# EAGLE design mainboard-nohdmi (EAGLE 8.4.1)

## Sheet 1 of 5
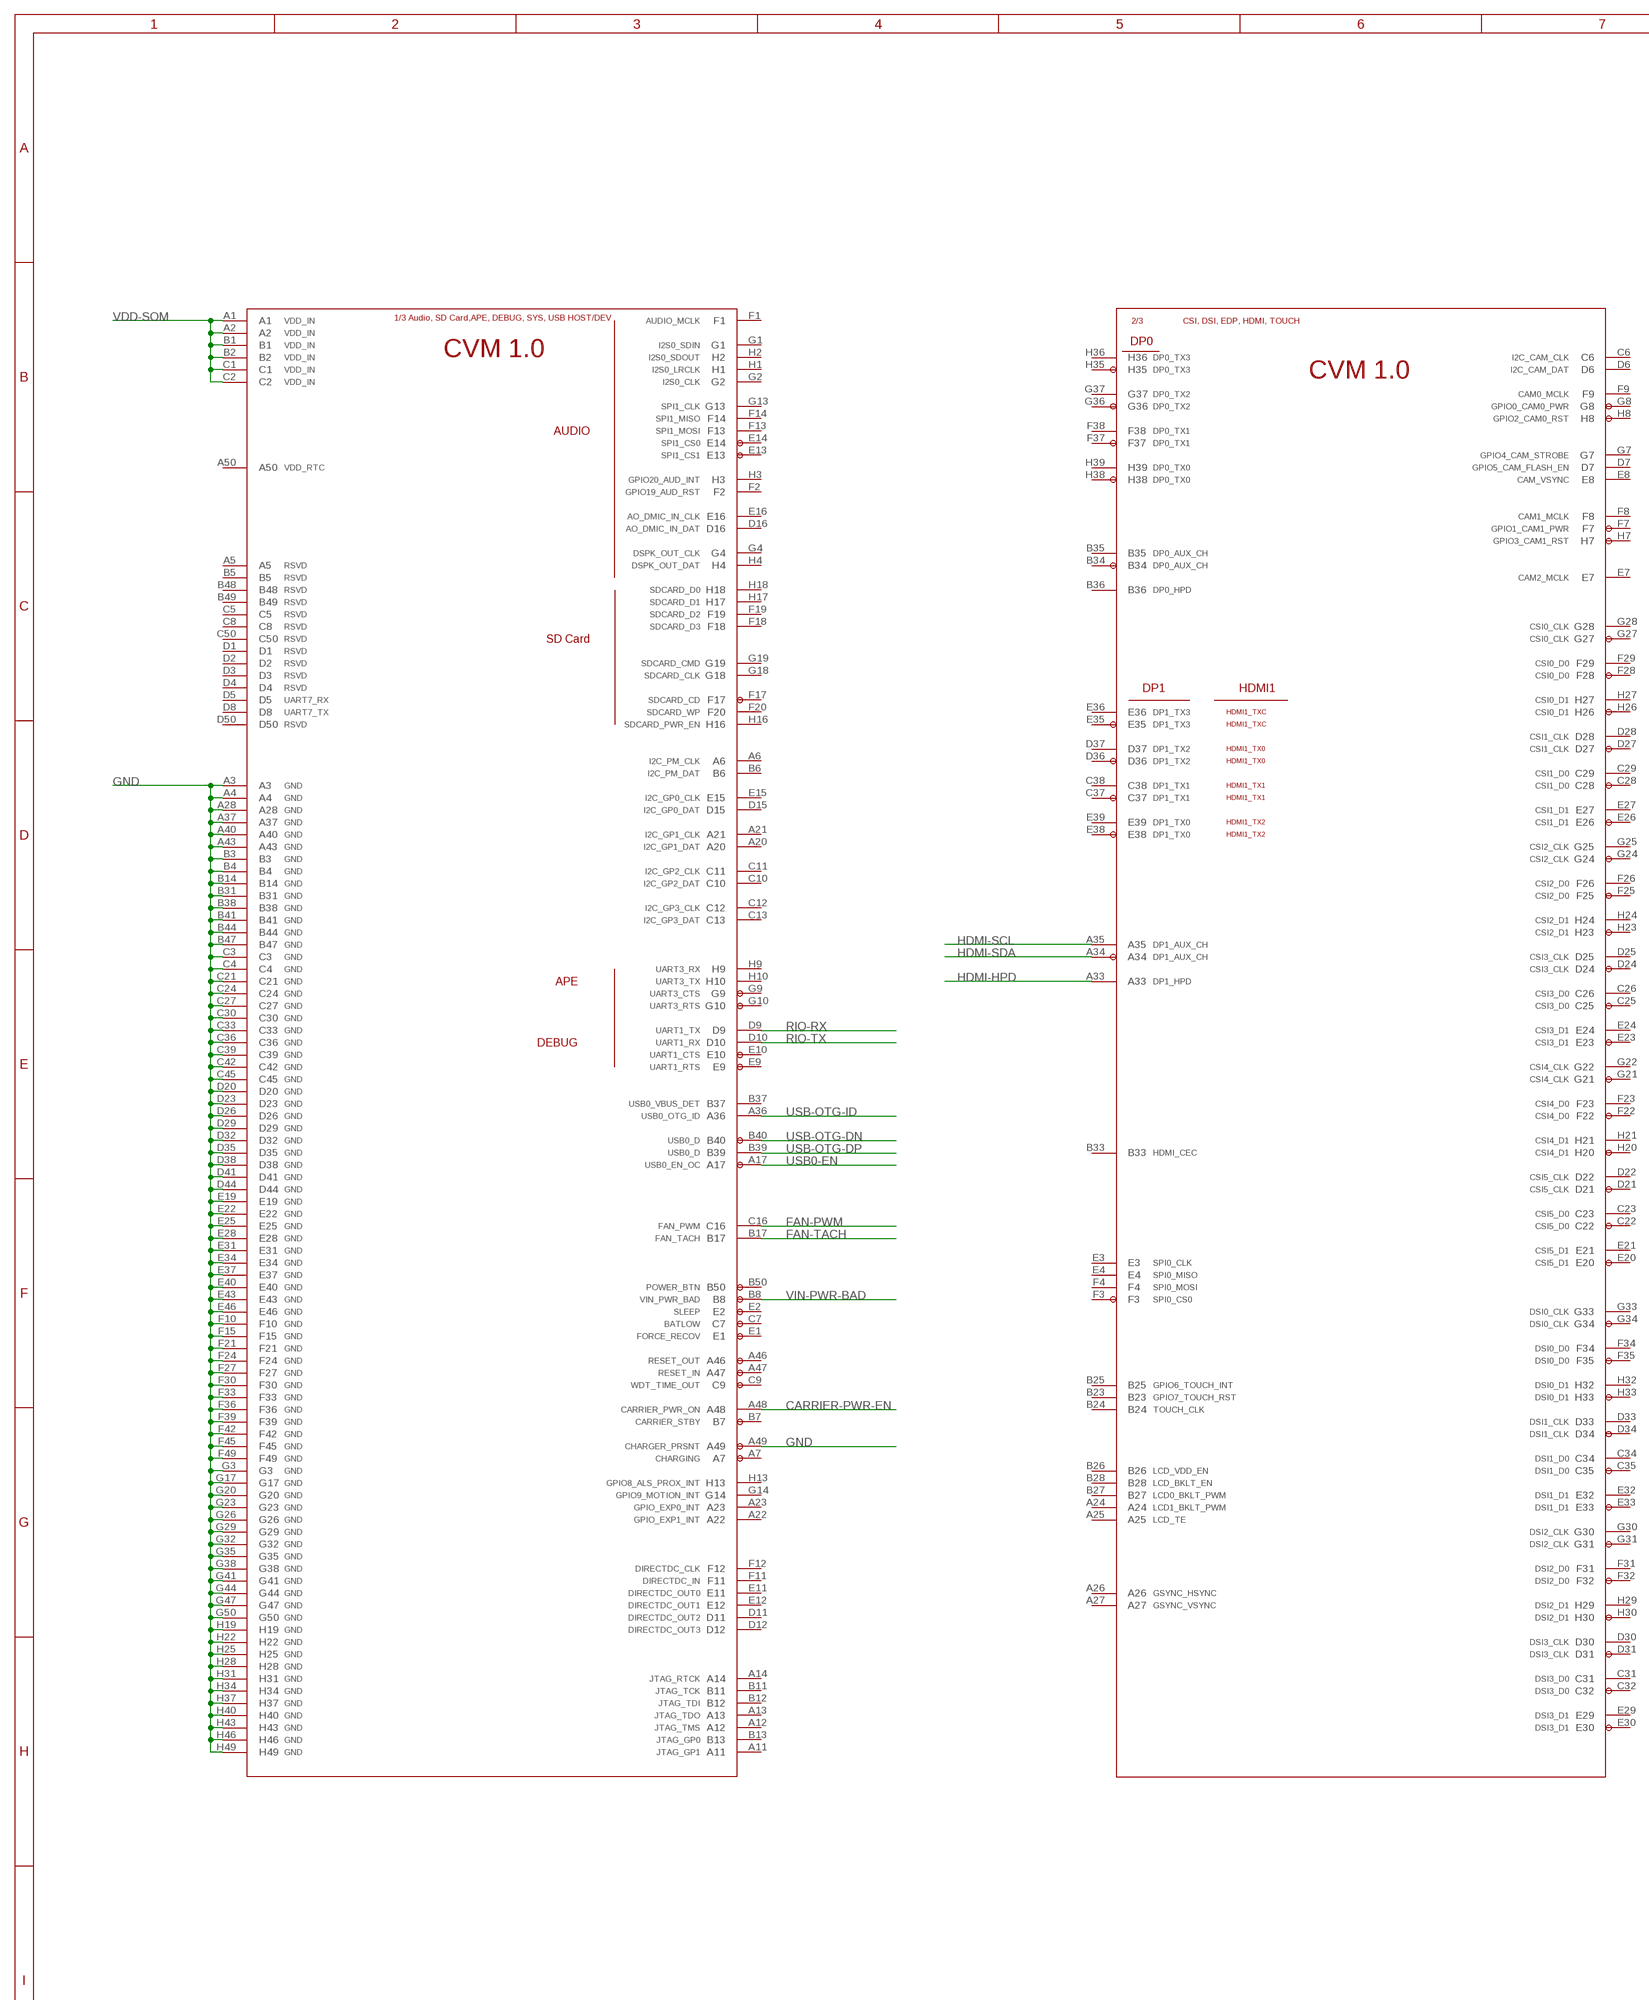
[diagram p0: schematic, sheet 1, part 1 of 2]
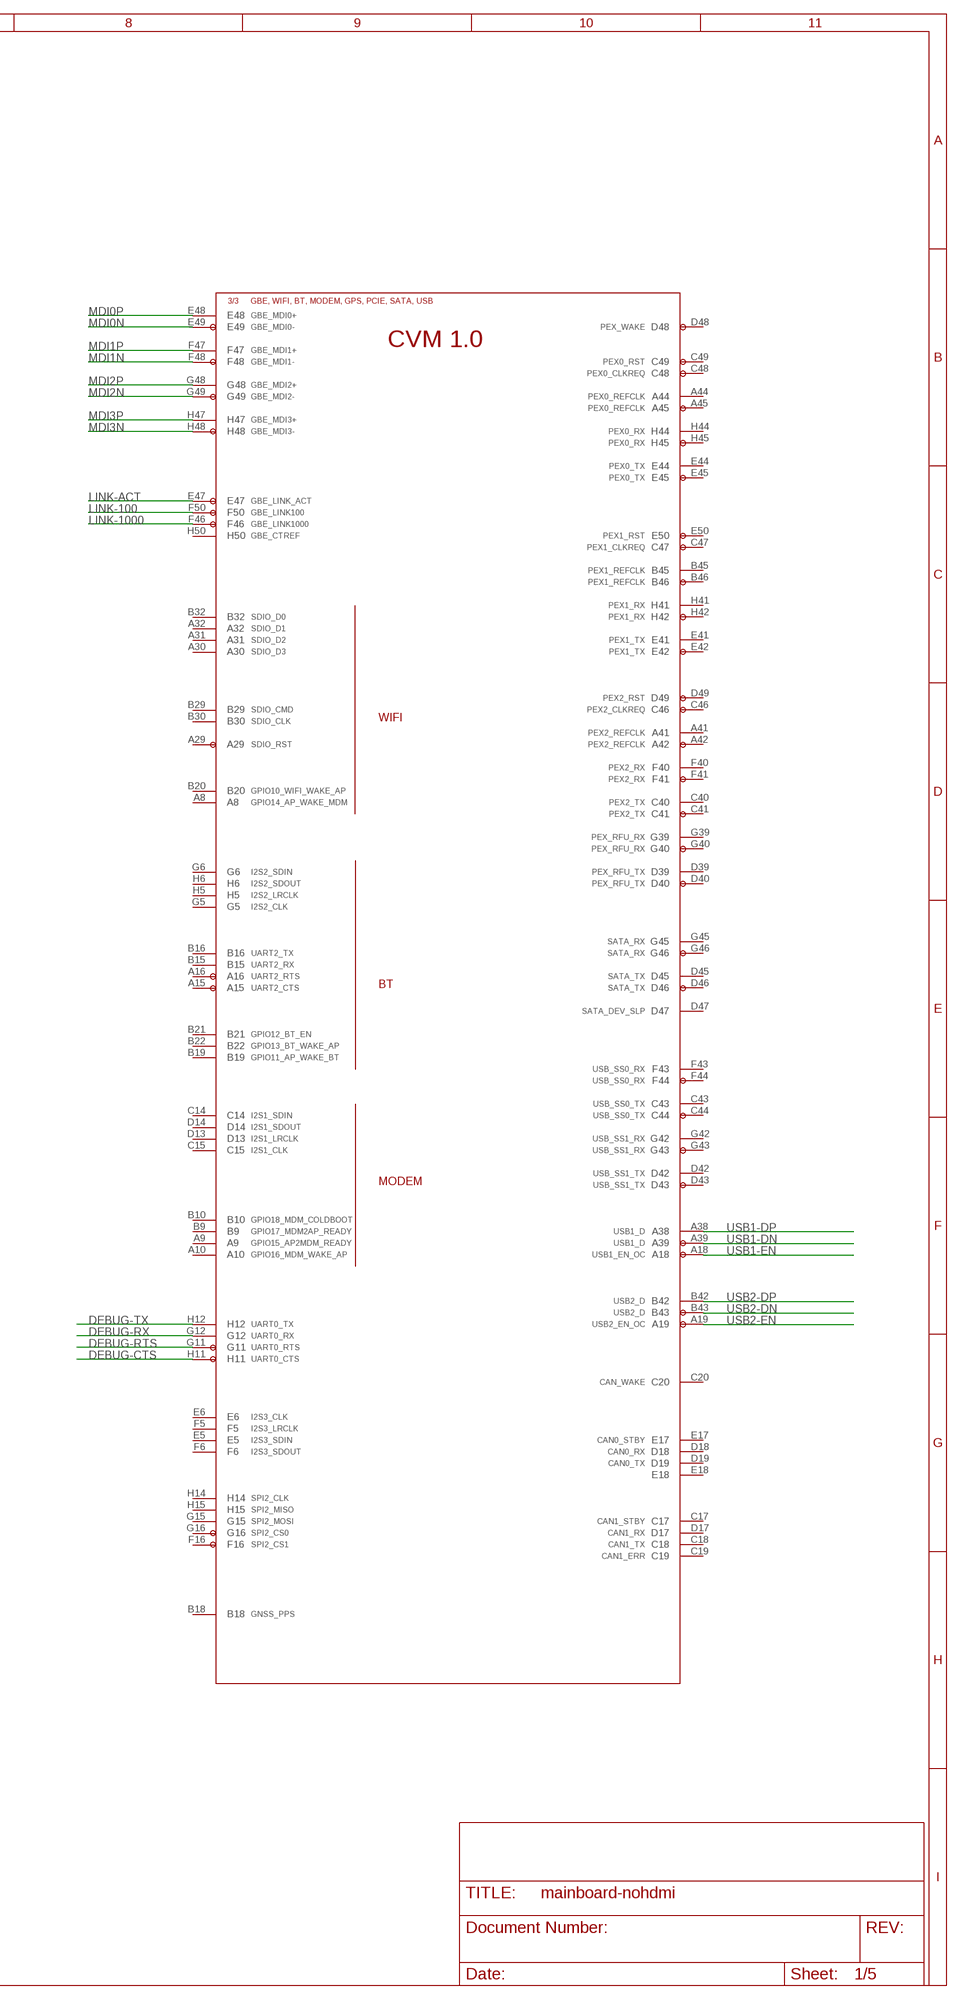
[diagram p1: schematic, sheet 1, part 2 of 2]

### Parts
U$1  JETSON-TX1  [SEAM-50-02.0-L-08-2-A-K-TR]

### Nets
CARRIER-PWR-EN: U$1.A48 ; also sheet 3
DEBUG-CTS: U$1.H11
DEBUG-RTS: U$1.G11
DEBUG-RX: U$1.G12 ; also sheet 3
DEBUG-TX: U$1.H12 ; also sheet 3
FAN-PWM: U$1.C16
FAN-TACH: U$1.B17
GND: U$1.A3 U$1.A4 U$1.A28 U$1.A37 U$1.A40 U$1.A43 U$1.A49 U$1.B3 U$1.B4 U$1.B14 U$1.B31 U$1.B38 U$1.B41 U$1.B44 U$1.B47 U$1.C3 U$1.C4 U$1.C21 U$1.C24 U$1.C27 U$1.C30 U$1.C33 U$1.C36 U$1.C39 U$1.C42 U$1.C45 U$1.D20 U$1.D23 U$1.D26 U$1.D29 U$1.D32 U$1.D35 U$1.D38 U$1.D41 U$1.D44 U$1.E19 U$1.E22 U$1.E25 U$1.E28 U$1.E31 U$1.E34 U$1.E37 U$1.E40 U$1.E43 U$1.E46 U$1.F10 U$1.F15 U$1.F21 U$1.F24 U$1.F27 U$1.F30 U$1.F33 U$1.F36 U$1.F39 U$1.F42 U$1.F45 U$1.F49 U$1.G3 U$1.G17 U$1.G20 U$1.G23 U$1.G26 U$1.G29 U$1.G32 U$1.G35 U$1.G38 U$1.G41 U$1.G44 U$1.G47 U$1.G50 U$1.H19 U$1.H22 U$1.H25 U$1.H28 U$1.H31 U$1.H34 U$1.H37 U$1.H40 U$1.H43 U$1.H46 U$1.H49 ; also sheet 2,3,4,5
HDMI-HPD: U$1.A33
HDMI-SCL: U$1.A35
HDMI-SDA: U$1.A34
LINK-100: U$1.F50 ; also sheet 5
LINK-1000: U$1.F46
LINK-ACT: U$1.E47 ; also sheet 5
MDI0N: U$1.E49 ; also sheet 5
MDI0P: U$1.E48 ; also sheet 5
MDI1N: U$1.F48 ; also sheet 5
MDI1P: U$1.F47 ; also sheet 5
MDI2N: U$1.G49 ; also sheet 5
MDI2P: U$1.G48 ; also sheet 5
MDI3N: U$1.H48 ; also sheet 5
MDI3P: U$1.H47 ; also sheet 5
RIO-RX: U$1.D9 ; also sheet 2
RIO-TX: U$1.D10 ; also sheet 2
USB0-EN: U$1.A17 ; also sheet 4
USB1-DN: U$1.A39 ; also sheet 4
USB1-DP: U$1.A38 ; also sheet 4
USB1-EN: U$1.A18 ; also sheet 4
USB2-DN: U$1.B43 ; also sheet 4
USB2-DP: U$1.B42 ; also sheet 4
USB2-EN: U$1.A19 ; also sheet 4
USB-OTG-DN: U$1.B40 ; also sheet 4
USB-OTG-DP: U$1.B39 ; also sheet 4
USB-OTG-ID: U$1.A36 ; also sheet 4
VDD-SOM: U$1.A1 U$1.A2 U$1.B1 U$1.B2 U$1.C1 U$1.C2 ; also sheet 3
VIN-PWR-BAD: U$1.B8 ; also sheet 3
Unconnected: U$1.A5 U$1.A6 U$1.A7 U$1.A8 U$1.A9 U$1.A10 U$1.A11 U$1.A12 U$1.A13 U$1.A14 U$1.A15 U$1.A16 U$1.A20 U$1.A21 U$1.A22 U$1.A23 U$1.A24 U$1.A25 U$1.A26 U$1.A27 U$1.A29 U$1.A30 U$1.A31 U$1.A32 U$1.A41 U$1.A42 U$1.A44 U$1.A45 U$1.A46 U$1.A47 U$1.A50 U$1.B5 U$1.B6 U$1.B7 U$1.B9 U$1.B10 U$1.B11 U$1.B12 U$1.B13 U$1.B15 U$1.B16 U$1.B18 U$1.B19 U$1.B20 U$1.B21 U$1.B22 U$1.B23 U$1.B24 U$1.B25 U$1.B26 U$1.B27 U$1.B28 U$1.B29 U$1.B30 U$1.B32 U$1.B33 U$1.B34 U$1.B35 U$1.B36 U$1.B37 U$1.B45 U$1.B46 U$1.B48 U$1.B49 U$1.B50 U$1.C5 U$1.C6 U$1.C7 U$1.C8 U$1.C9 U$1.C10 U$1.C11 U$1.C12 U$1.C13 U$1.C14 U$1.C15 U$1.C17 U$1.C18 U$1.C19 U$1.C20 U$1.C22 U$1.C23 U$1.C25 U$1.C26 U$1.C28 U$1.C29 U$1.C31 U$1.C32 U$1.C34 U$1.C35 U$1.C37 U$1.C38 U$1.C40 U$1.C41 U$1.C43 U$1.C44 U$1.C46 U$1.C47 U$1.C48 U$1.C49 U$1.C50 U$1.D1 U$1.D2 U$1.D3 U$1.D4 U$1.D5 U$1.D6 U$1.D7 U$1.D8 U$1.D11 U$1.D12 U$1.D13 U$1.D14 U$1.D15 U$1.D16 U$1.D17 U$1.D18 U$1.D19 U$1.D21 U$1.D22 U$1.D24 U$1.D25 U$1.D27 U$1.D28 U$1.D30 U$1.D31 U$1.D33 U$1.D34 U$1.D36 U$1.D37 U$1.D39 U$1.D40 U$1.D42 U$1.D43 U$1.D45 U$1.D46 U$1.D47 U$1.D48 U$1.D49 U$1.D50 U$1.E1 U$1.E2 U$1.E3 U$1.E4 U$1.E5 U$1.E6 U$1.E7 U$1.E8 U$1.E9 U$1.E10 U$1.E11 U$1.E12 U$1.E13 U$1.E14 U$1.E15 U$1.E16 U$1.E17 U$1.E18 U$1.E20 U$1.E21 U$1.E23 U$1.E24 U$1.E26 U$1.E27 U$1.E29 U$1.E30 U$1.E32 U$1.E33 U$1.E35 U$1.E36 U$1.E38 U$1.E39 U$1.E41 U$1.E42 U$1.E44 U$1.E45 U$1.E50 U$1.F1 U$1.F2 U$1.F3 U$1.F4 U$1.F5 U$1.F6 U$1.F7 U$1.F8 U$1.F9 U$1.F11 U$1.F12 U$1.F13 U$1.F14 U$1.F16 U$1.F17 U$1.F18 U$1.F19 U$1.F20 U$1.F22 U$1.F23 U$1.F25 U$1.F26 U$1.F28 U$1.F29 U$1.F31 U$1.F32 U$1.F34 U$1.F35 U$1.F37 U$1.F38 U$1.F40 U$1.F41 U$1.F43 U$1.F44 U$1.G1 U$1.G2 U$1.G4 U$1.G5 U$1.G6 U$1.G7 U$1.G8 U$1.G9 U$1.G10 U$1.G13 U$1.G14 U$1.G15 U$1.G16 U$1.G18 U$1.G19 U$1.G21 U$1.G22 U$1.G24 U$1.G25 U$1.G27 U$1.G28 U$1.G30 U$1.G31 U$1.G33 U$1.G34 U$1.G36 U$1.G37 U$1.G39 U$1.G40 U$1.G42 U$1.G43 U$1.G45 U$1.G46 U$1.H1 U$1.H2 U$1.H3 U$1.H4 U$1.H5 U$1.H6 U$1.H7 U$1.H8 U$1.H9 U$1.H10 U$1.H13 U$1.H14 U$1.H15 U$1.H16 U$1.H17 U$1.H18 U$1.H20 U$1.H21 U$1.H23 U$1.H24 U$1.H26 U$1.H27 U$1.H29 U$1.H30 U$1.H32 U$1.H33 U$1.H35 U$1.H36 U$1.H38 U$1.H39 U$1.H41 U$1.H42 U$1.H44 U$1.H45 U$1.H50

## Sheet 2 of 5: MXP connector
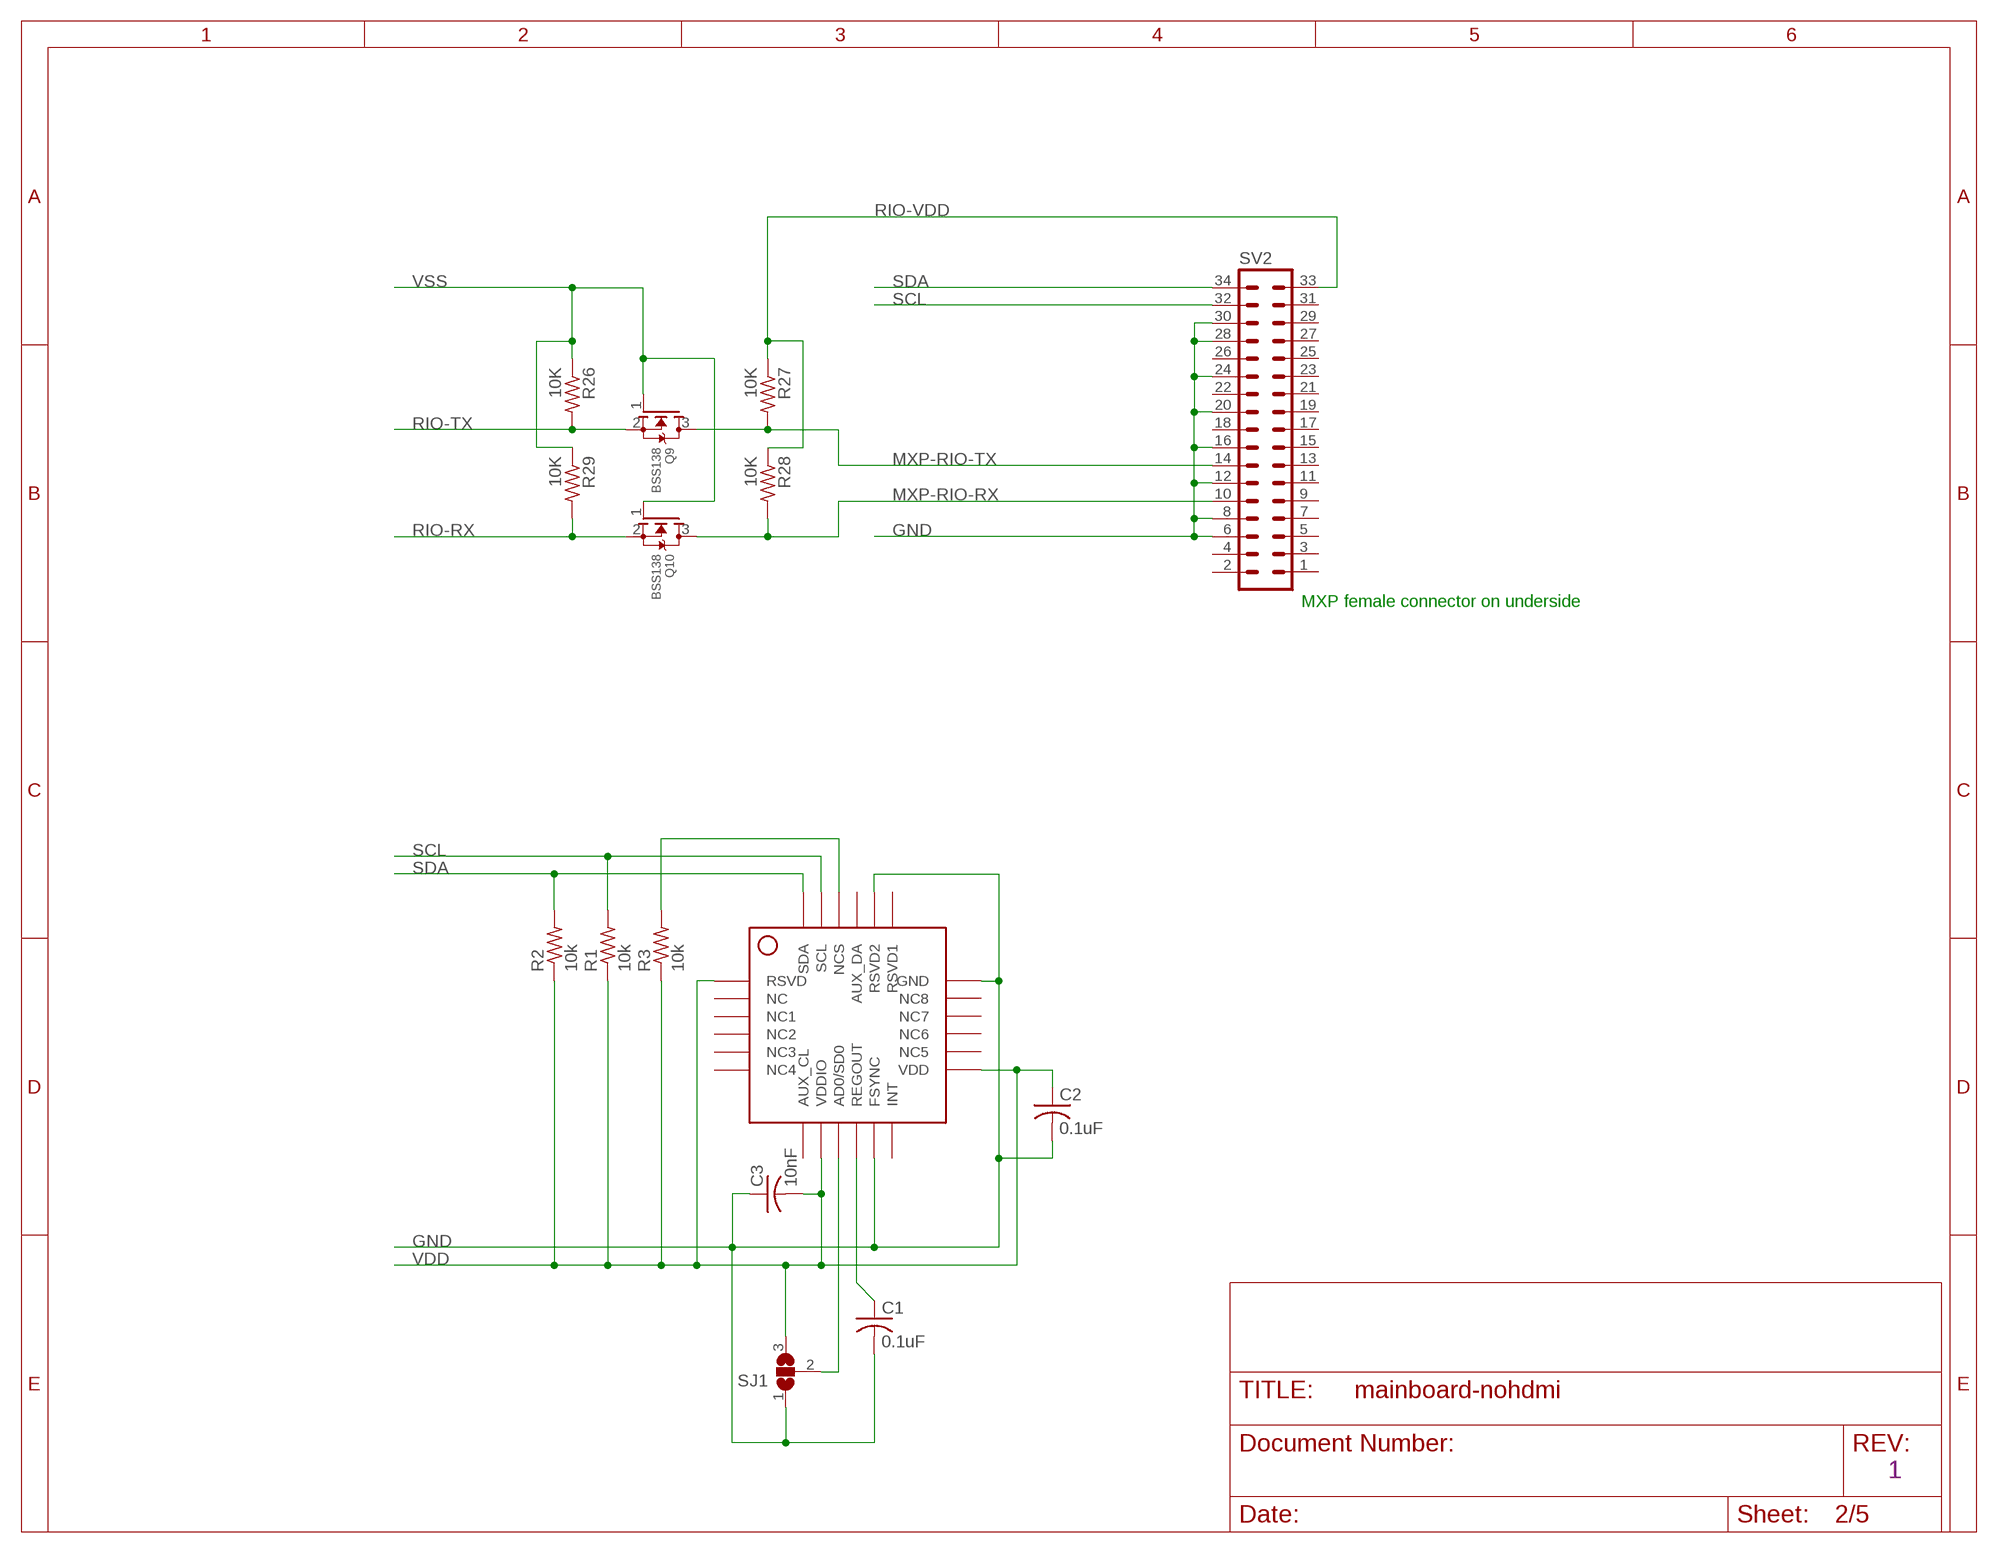
[diagram p2: schematic, sheet 2]

### Parts
C1  0.1uF  C-USC0603  [C0603]
C2  0.1uF  C-USC0603  [C0603]
C3  10nF  C-USC0603  [C0603]
Q9  BSS138  MOSFET-NREFLOW  [SOT23]
Q10  BSS138  MOSFET-NREFLOW  [SOT23]
R1  10k  R-US_R0603  [R0603]
R2  10k  R-US_R0603  [R0603]
R3  10k  R-US_R0603  [R0603]
R26  10K  R-US_R0603  [R0603]
R27  10K  R-US_R0603  [R0603]
R28  10K  R-US_R0603  [R0603]
R29  10K  R-US_R0603  [R0603]
SJ1  SJ2W  [SJ_2]
SV2  MA17-2  [MA17-2]
U$4  MPU9250  [QFN3X3]

### Nets
GND: C1.2 C2.2 C3.1 SJ1.1 SV2.6 SV2.8 SV2.12 SV2.16 SV2.20 SV2.24 SV2.28 SV2.30 U$4.P$11(FSYNC) U$4.P$18(GND) U$4.P$20(RSVD2) U$4.P$25(GND) ; also sheet 1,3,4,5
MXP-RIO-RX: Q10.3(D) R28.2 SV2.10
MXP-RIO-TX: Q9.3(D) R27.2 SV2.14
N$7: C1.1 U$4.P$10(REGOUT)
N$8: SJ1.2 U$4.P$9(AD0/SD0)
N$9: R3.2 U$4.P$22(NCS)
RIO-RX: Q10.2(S) R29.2 ; also sheet 1
RIO-TX: Q9.2(S) R26.2 ; also sheet 1
RIO-VDD: R27.1 R28.1 SV2.33
SCL: R1.2 SV2.32 U$4.P$23(SCL)
SDA: R2.2 SV2.34 U$4.P$24(SDA)
VDD: C2.1 C3.2 R1.1 R2.1 R3.1 SJ1.3 U$4.P$1(RSVD) U$4.P$8(VDDIO) U$4.P$13(VDD) ; also sheet 3,5
VSS: Q9.1(G) Q10.1(G) R26.1 R29.1 ; also sheet 3
Unconnected: SV2.1 SV2.2 SV2.3 SV2.4 SV2.5 SV2.7 SV2.9 SV2.11 SV2.13 SV2.15 SV2.17 SV2.18 SV2.19 SV2.21 SV2.22 SV2.23 SV2.25 SV2.26 SV2.27 SV2.29 SV2.31 U$4.P$2(NC) U$4.P$3(NC1) U$4.P$4(NC2) U$4.P$5(NC3) U$4.P$6(NC4) U$4.P$7(AUX_CL) U$4.P$12(INT) U$4.P$14(NC5) U$4.P$15(NC6) U$4.P$16(NC7) U$4.P$17(NC8) U$4.P$19(RSVD1) U$4.P$21(AUX_DA)

### Notes on the sheet
- MXP female connector on underside
- 1

## Sheet 3 of 5: Other onboard IO
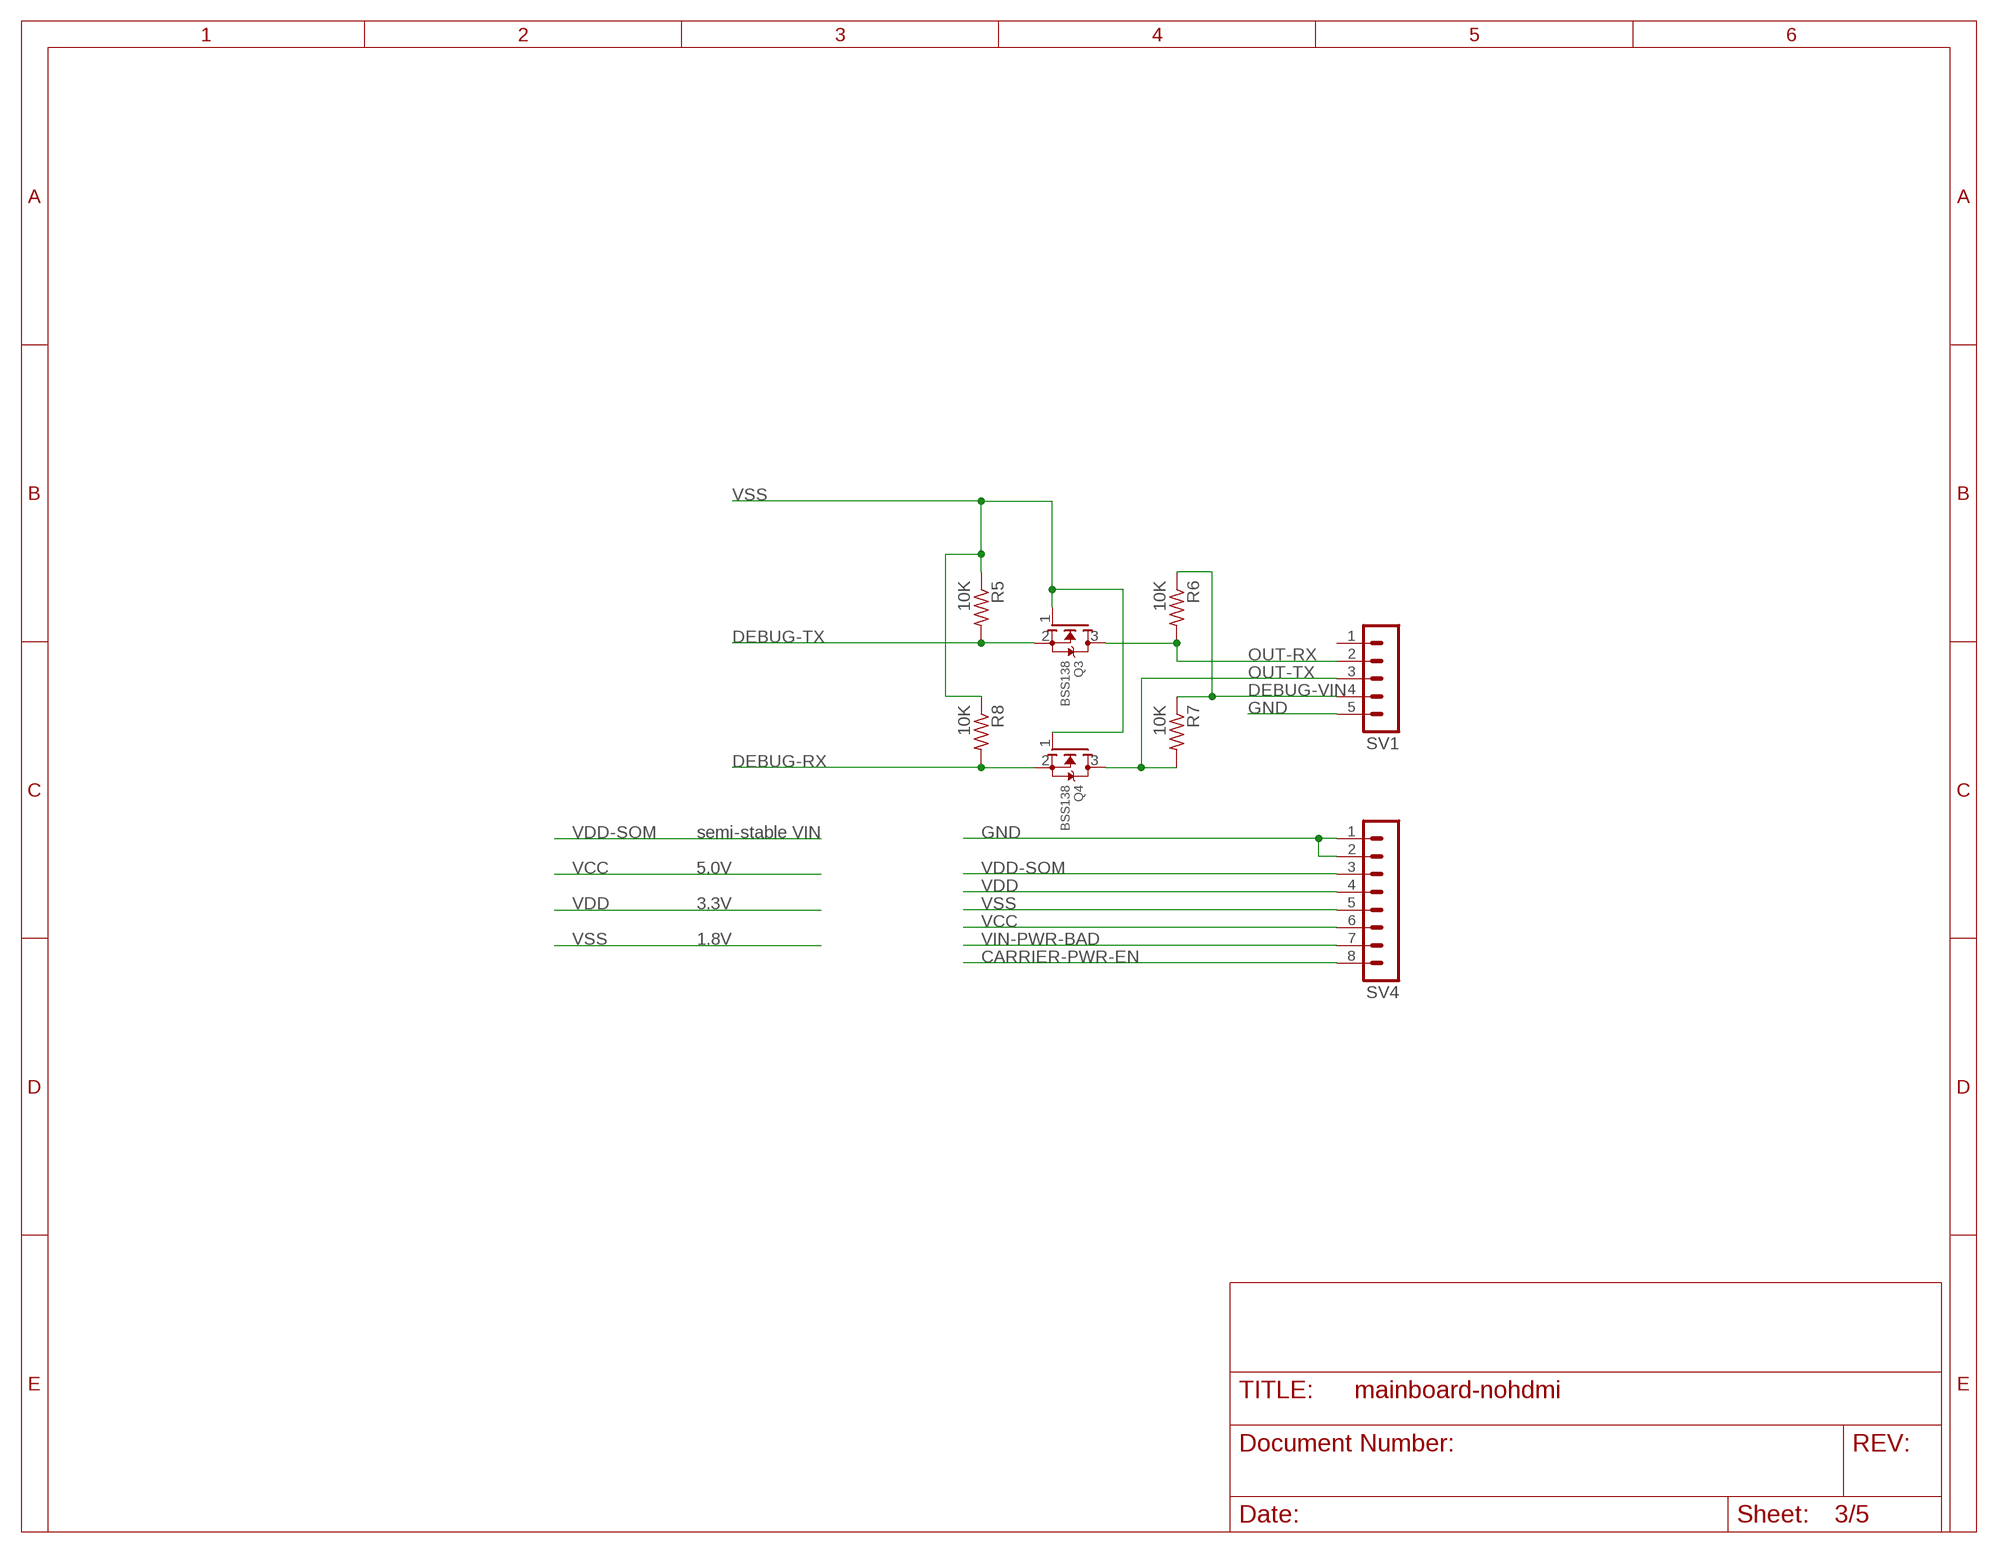
[diagram p3: schematic, sheet 3]

### Parts
Q3  BSS138  MOSFET-NREFLOW  [SOT23]
Q4  BSS138  MOSFET-NREFLOW  [SOT23]
R5  10K  R-US_R0603  [R0603]
R6  10K  R-US_R0603  [R0603]
R7  10K  R-US_R0603  [R0603]
R8  10K  R-US_R0603  [R0603]
SV1  MA05-1  [MA05-1]
SV4  MA08-1  [MA08-1]

### Nets
CARRIER-PWR-EN: SV4.8 ; also sheet 1
DEBUG-RX: Q4.2(S) R8.2 ; also sheet 1
DEBUG-TX: Q3.2(S) R5.2 ; also sheet 1
DEBUG-VIN: R6.1 R7.1 SV1.4
GND: SV1.5 SV4.1 SV4.2 ; also sheet 1,2,4,5
OUT-RX: Q3.3(D) R6.2 SV1.2
OUT-TX: Q4.3(D) R7.2 SV1.3
VCC: SV4.6 ; also sheet 4
VDD: SV4.4 ; also sheet 2,5
VDD-SOM: SV4.3 ; also sheet 1
VIN-PWR-BAD: SV4.7 ; also sheet 1
VSS: Q3.1(G) Q4.1(G) R5.1 R8.1 SV4.5 ; also sheet 2
Unconnected: SV1.1

### Notes on the sheet
- semi-stable VIN
- 5.0V
- 3.3V
- 1.8V

## Sheet 4 of 5: USB ports and load switches
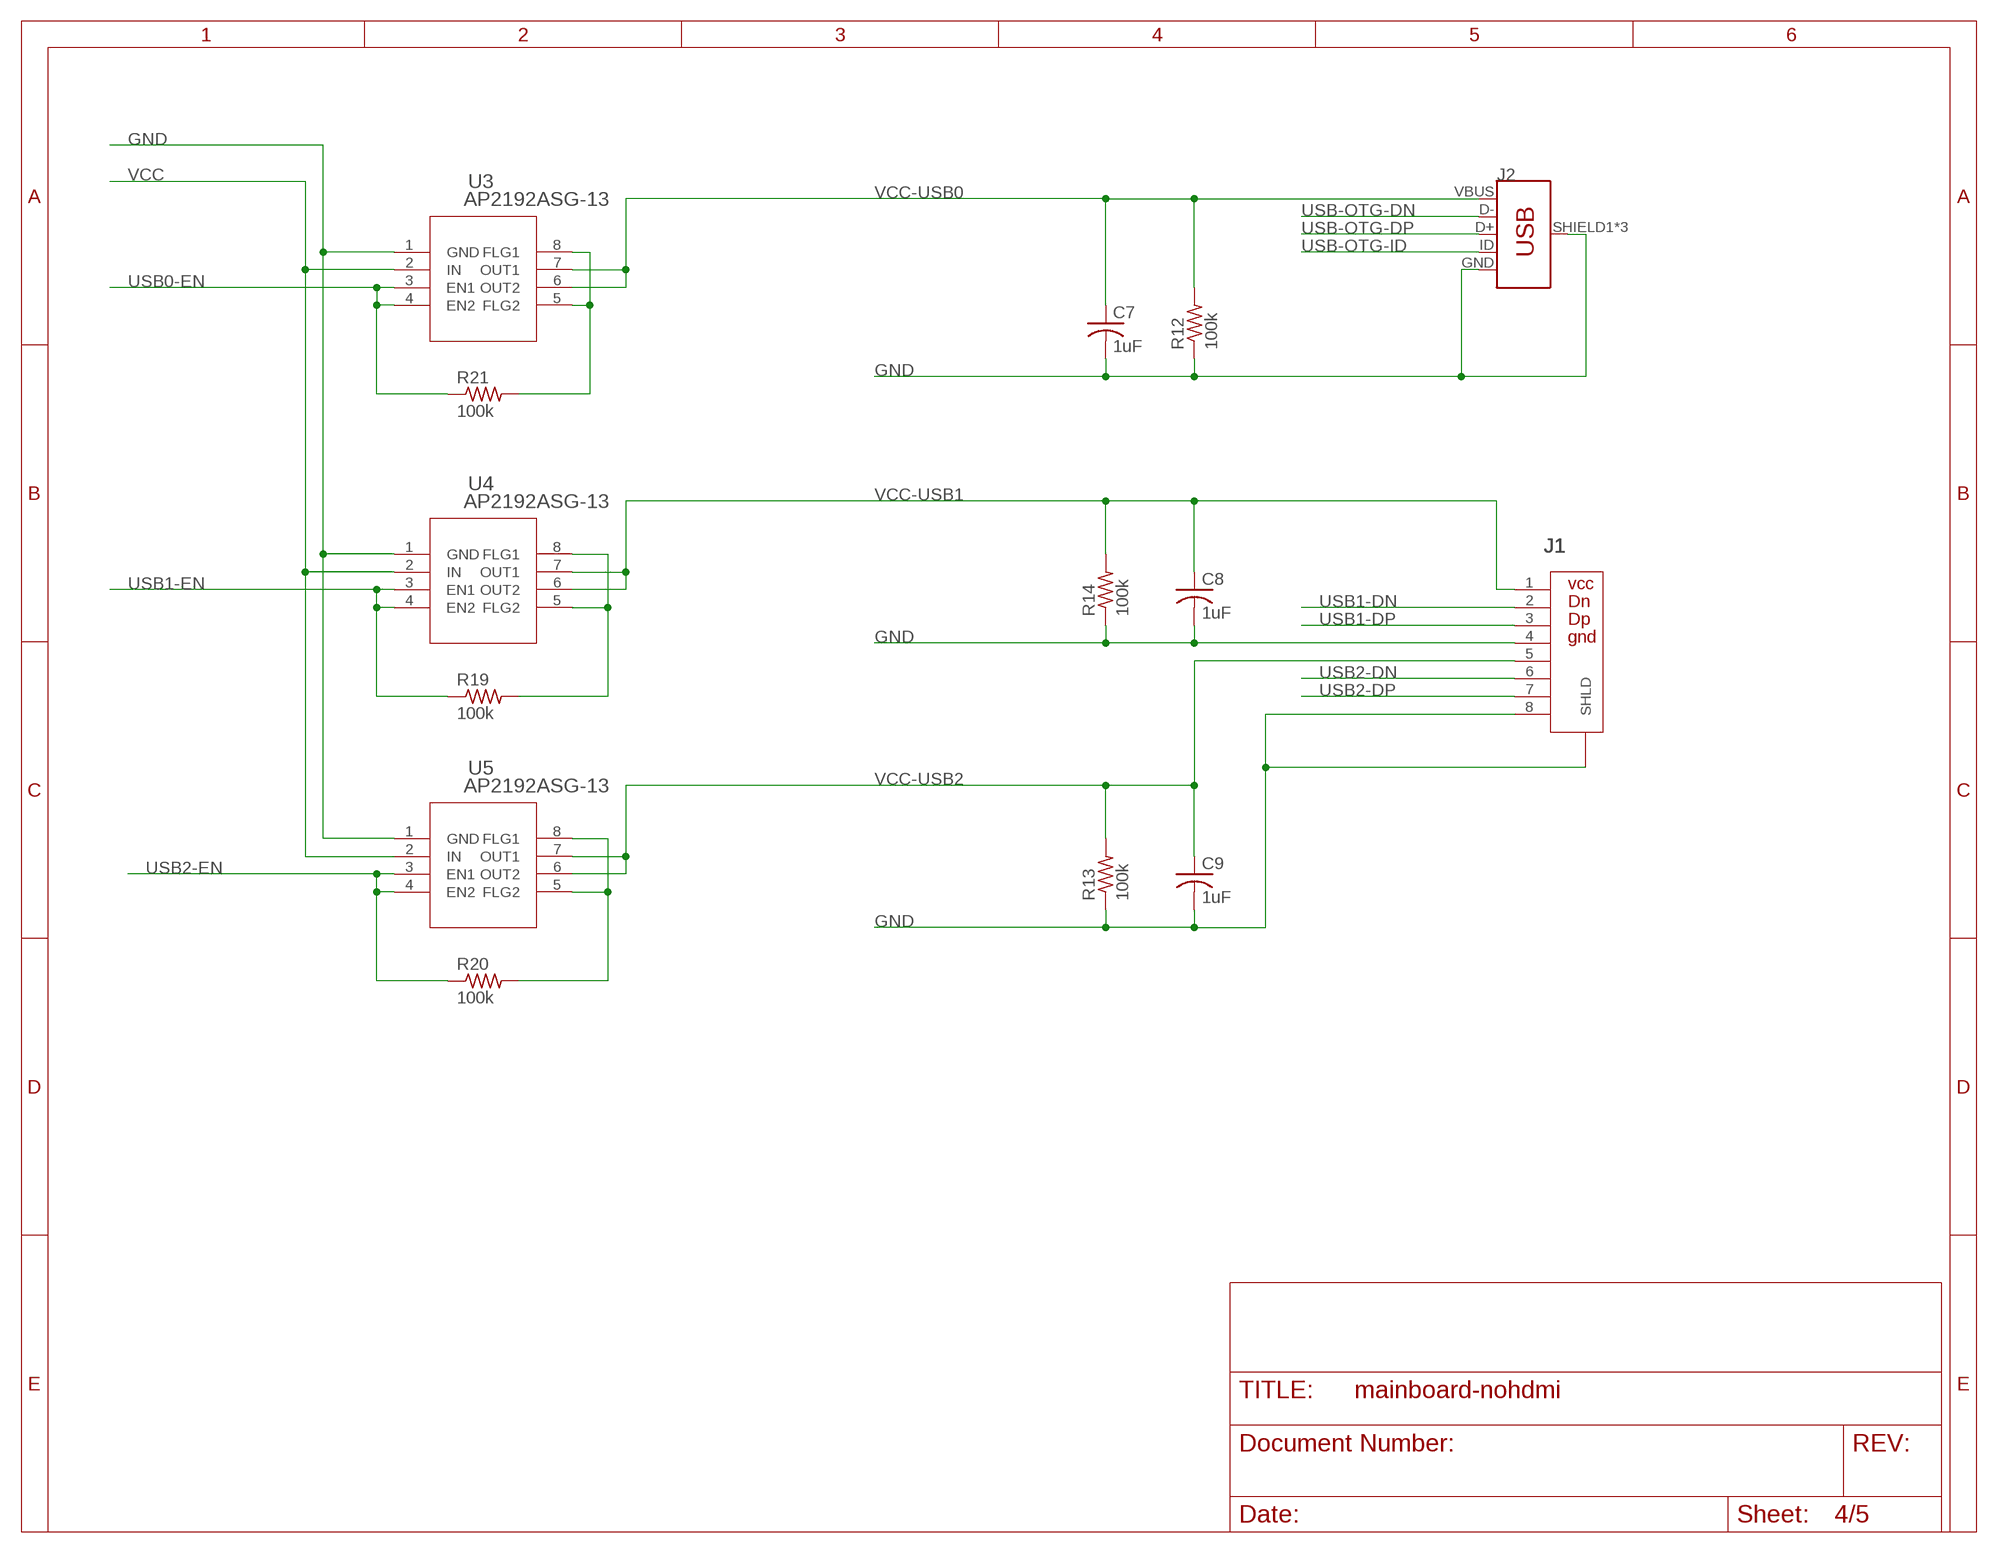
[diagram p4: schematic, sheet 4]

### Parts
C7  1uF  C-USC0805  [C0805]
C8  1uF  C-USC0805  [C0805]
C9  1uF  C-USC0805  [C0805]
J1  1903815-1  [CONN_1903815-1]
J2  USB_MICRO-B_FEMALE-SMT  [USB-B-MICRO-SMD]
R12  100k  R-US_R0603  [R0603]
R13  100k  R-US_R0603  [R0603]
R14  100k  R-US_R0603  [R0603]
R19  100k  R-US_R0603  [R0603]
R20  100k  R-US_R0603  [R0603]
R21  100k  R-US_R0603  [R0603]
U3  AP2192ASG-13  [SO8]
U4  AP2192ASG-13  [SO8]
U5  AP2192ASG-13  [SO8]

### Nets
GND: C7.2 C8.2 C9.2 J1.4 J1.8 J1.SHLD1(SHLD) J1.SHLD2(SHLD) J1.SHLD3(SHLD) J1.SHLD4(SHLD) J2.GND J2.SHIELD1(SHIELD) J2.SHIELD2(SHIELD) J2.SHIELD3(SHIELD) R12.1 R13.1 R14.1 U3.1(GND) U4.1(GND) U5.1(GND) ; also sheet 1,2,3,5
N$4: R20.2 U5.5(FLG2) U5.8(FLG1)
N$5: R19.2 U4.5(FLG2) U4.8(FLG1)
N$6: R21.2 U3.5(FLG2) U3.8(FLG1)
USB0-EN: R21.1 U3.3(EN1) U3.4(EN2) ; also sheet 1
USB1-DN: J1.2 ; also sheet 1
USB1-DP: J1.3 ; also sheet 1
USB1-EN: R19.1 U4.3(EN1) U4.4(EN2) ; also sheet 1
USB2-DN: J1.6 ; also sheet 1
USB2-DP: J1.7 ; also sheet 1
USB2-EN: R20.1 U5.3(EN1) U5.4(EN2) ; also sheet 1
USB-OTG-DN: J2.D- ; also sheet 1
USB-OTG-DP: J2.D+ ; also sheet 1
USB-OTG-ID: J2.ID ; also sheet 1
VCC: U3.2(IN) U4.2(IN) U5.2(IN) ; also sheet 3
VCC-USB0: C7.1 J2.VBUS R12.2 U3.6(OUT2) U3.7(OUT1)
VCC-USB1: C8.1 J1.1 R14.2 U4.6(OUT2) U4.7(OUT1)
VCC-USB2: C9.1 J1.5 R13.2 U5.6(OUT2) U5.7(OUT1)

## Sheet 5 of 5: gigabit networking
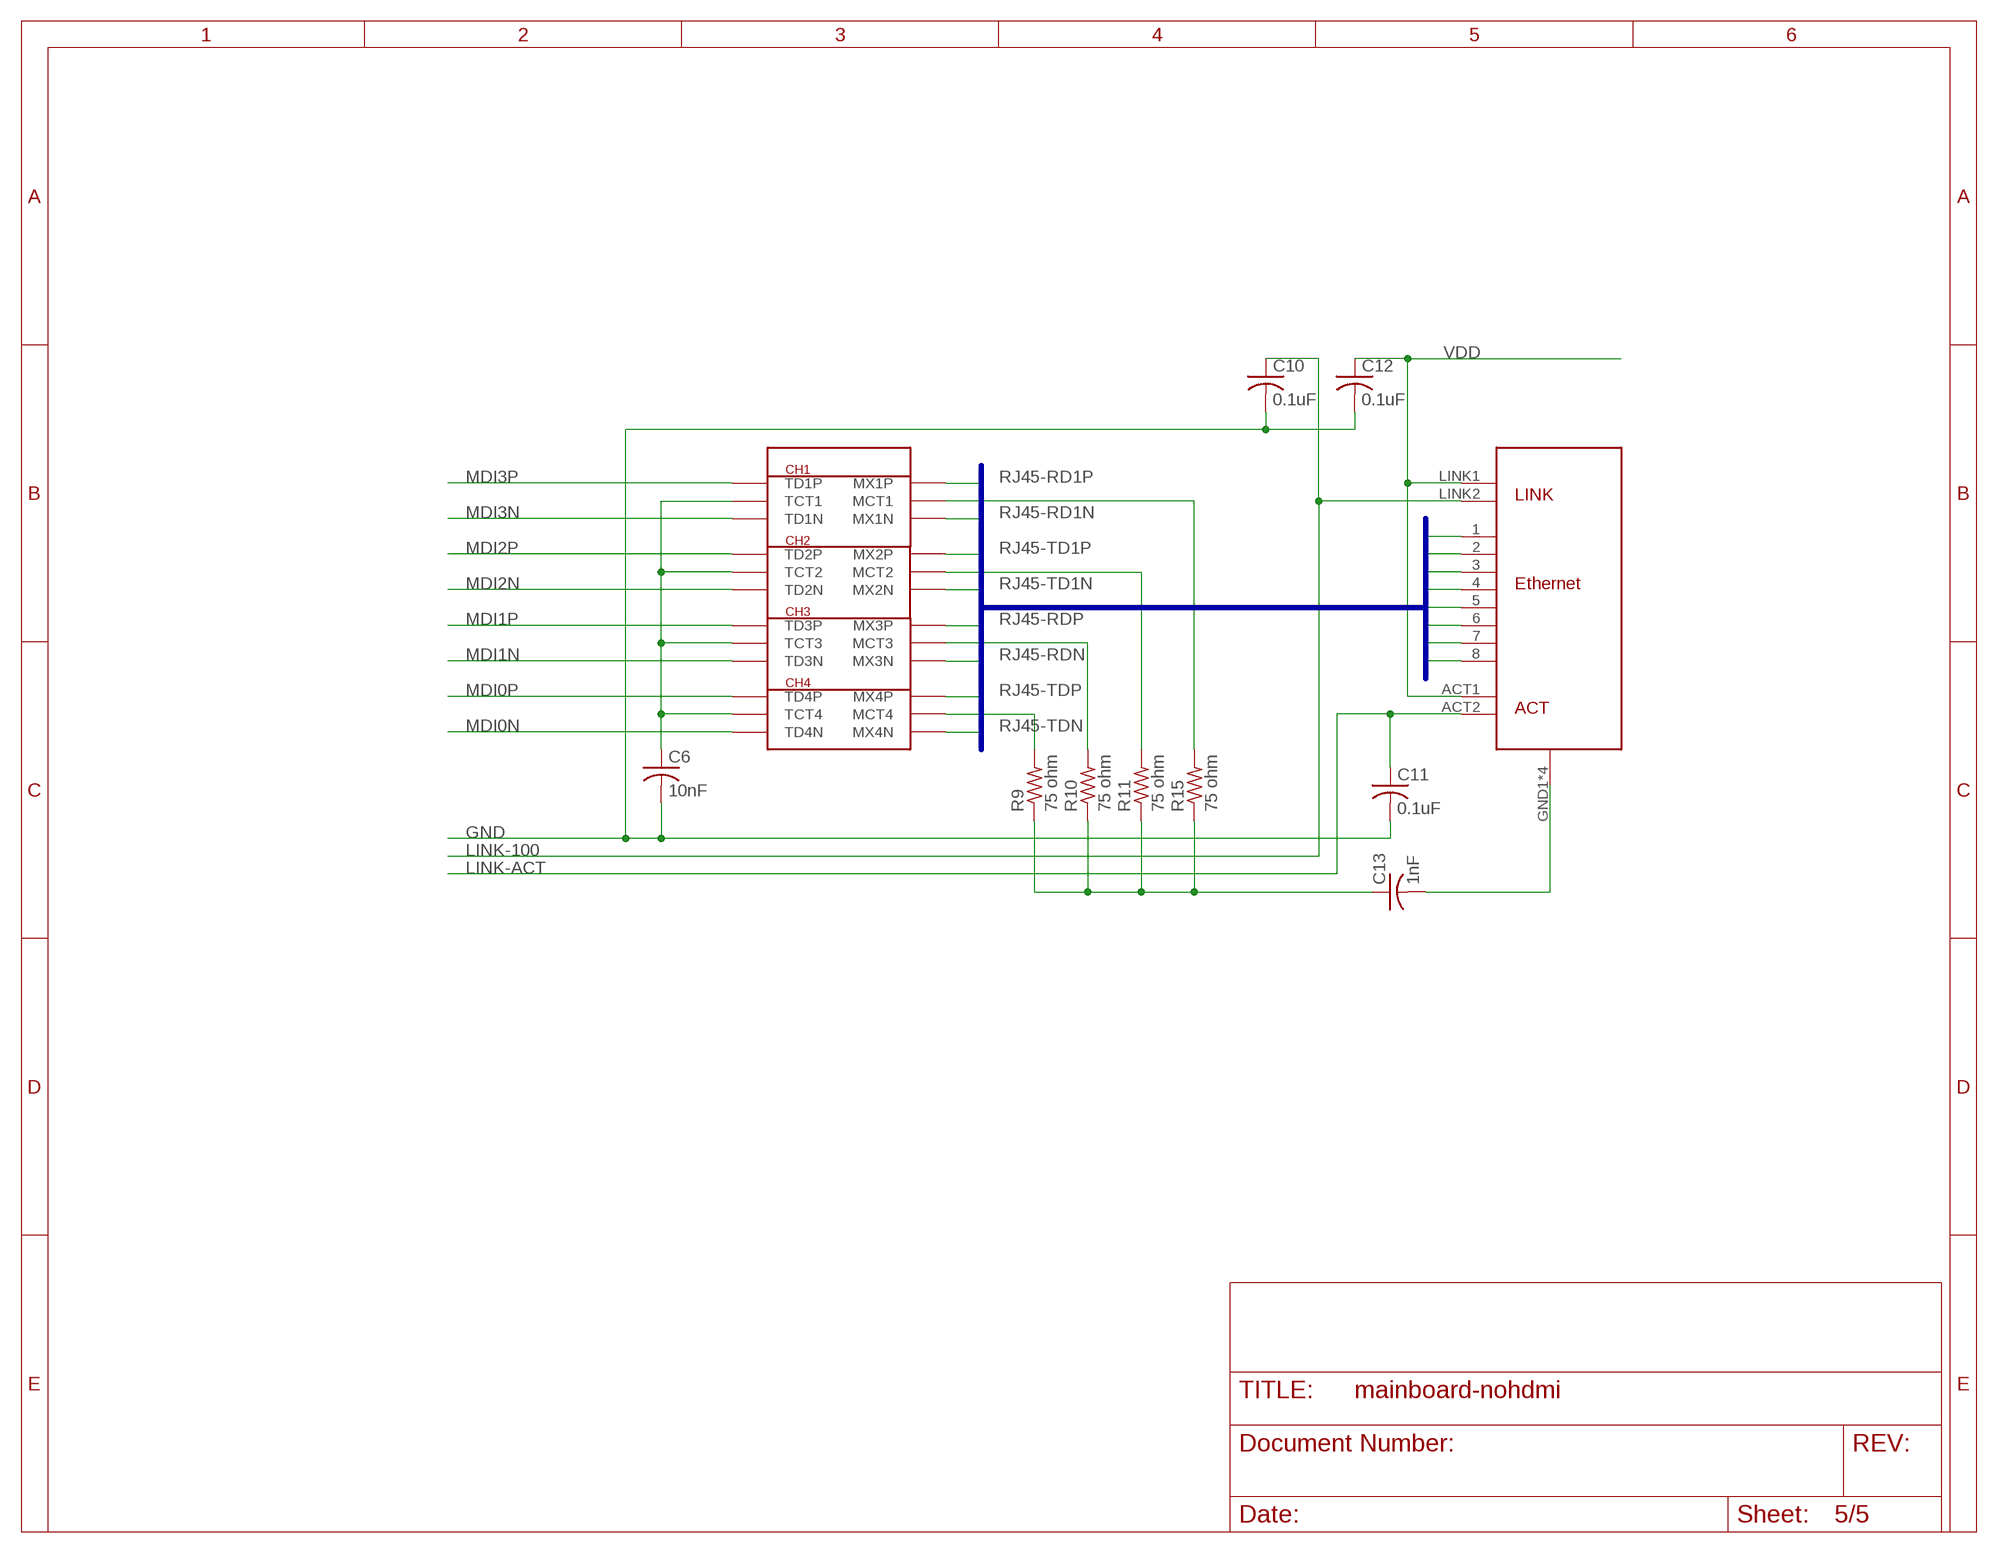
[diagram p5: schematic, sheet 5]

### Parts
C6  10nF  C-USC0805  [C0805]
C10  0.1uF  C-USC0805  [C0805]
C11  0.1uF  C-USC0805  [C0805]
C12  0.1uF  C-USC0805  [C0805]
C13  1nF  C-USC0805  [C0805]
R9  75 ohm  R-US_R0603  [R0603]
R10  75 ohm  R-US_R0603  [R0603]
R11  75 ohm  R-US_R0603  [R0603]
R15  75 ohm  R-US_R0603  [R0603]
U$3  2-406549-1  [2-406549-1]
U$5  H6062NL  [H60XXNL]

### Nets
GND: C6.2 C10.2 C11.2 C12.2 ; also sheet 1,2,3,4
LINK-100: C10.1 U$3.LINK2 ; also sheet 1
LINK-ACT: C11.1 U$3.ACT2 ; also sheet 1
MDI0N: U$5.P$24(TD4N) ; also sheet 1
MDI0P: U$5.P$22(TD4P) ; also sheet 1
MDI1N: U$5.P$21(TD3N) ; also sheet 1
MDI1P: U$5.P$19(TD3P) ; also sheet 1
MDI2N: U$5.P$18(TD2N) ; also sheet 1
MDI2P: U$5.P$16(TD2P) ; also sheet 1
MDI3N: U$5.P$15(TD1N) ; also sheet 1
MDI3P: U$5.P$13(TD1P) ; also sheet 1
N$1: C13.2 U$3.GND1 U$3.GND2 U$3.GND3 U$3.GND4
N$48: R9.2 U$5.P$11(MCT4)
N$49: R10.2 U$5.P$8(MCT3)
N$50: R11.2 U$5.P$5(MCT2)
N$51: R15.2 U$5.P$2(MCT1)
N$52: C13.1 R9.1 R10.1 R11.1 R15.1
N$72: C6.1 U$5.P$14(TCT1) U$5.P$17(TCT2) U$5.P$20(TCT3) U$5.P$23(TCT4)
RJ45-RD1N: U$3.8 U$5.P$3(MX1N)
RJ45-RD1P: U$3.7 U$5.P$1(MX1P)
RJ45-RDN: U$3.6 U$5.P$9(MX3N)
RJ45-RDP: U$3.3 U$5.P$7(MX3P)
RJ45-TD1N: U$3.5 U$5.P$6(MX2N)
RJ45-TD1P: U$3.4 U$5.P$4(MX2P)
RJ45-TDN: U$3.2 U$5.P$12(MX4N)
RJ45-TDP: U$3.1 U$5.P$10(MX4P)
VDD: C12.1 U$3.ACT1 U$3.LINK1 ; also sheet 2,3

### Buses
B$1

## Library data of the parts
C1-C3 C7-C12 = rcl:C-US: CAPACITOR, American symbol
C6 C13 = resistor:C-US: CAPACITOR, American symbol
J1 = JetsonProj:1903815-1; MANUFACTURER_PART_NUMBER: 19038151; VENDOR: Tyco Electronics
J2 = SparkFun-Connectors:USB_MICRO-B: USB Type Micro-B Connector Male/female and PTH/SMT variants SparkFun Products: SparkFun microB USB Breakout <https://www.sparkfun.com/products/12035> SparkFun USB microB Plug Breakout <https://www.sparkfun.com/products/10031> SparkFun ESP8266 Thing <https://www.sparkfun.com/products/13231>; PROD_ID: CONN-11752
Q3 Q4 Q9 Q10 = adafruit:MOSFET-N: N-Channel Mosfet 2N7002E - 60V 260mA SOT23 [Digikey: 2N7002ET1GOSTR-ND] - REEL BSH103 - 30V 850mA SOT23 [Digikey: 568-5013-1-ND]
R1-R3 R12-R14 R19-R21 = rcl:R-US_: RESISTOR, American symbol; SPICEPREFIX: R
R5-R8 R26-R29 = adafruit:R-US_: RESISTOR, American symbol
R9-R11 R15 = resistor:R-US_: RESISTOR, American symbol
SJ1 = jumper:SJ2W: SMD solder JUMPER
SV1 = con-lstb:MA05-1: PIN HEADER; OC_FARNELL: unknown; OC_NEWARK: unknown
SV2 = con-lstb:MA17-2: PIN HEADER; OC_FARNELL: unknown; OC_NEWARK: unknown
SV4 = con-lstb:MA08-1: PIN HEADER; OC_FARNELL: unknown; OC_NEWARK: unknown
U3-U5 = JetsonProj:AP2192ASG-13; MANUFACTURER_PART_NUMBER: AP2192ASG13; VENDOR: Diodes Inc
U$1 = nvidia:JETSON-TX1
U$3 = JetsonProj:2-406549-1
U$4 = JetsonProj:MPU9250
U$5 = JetsonProj:H6062NL

## Board
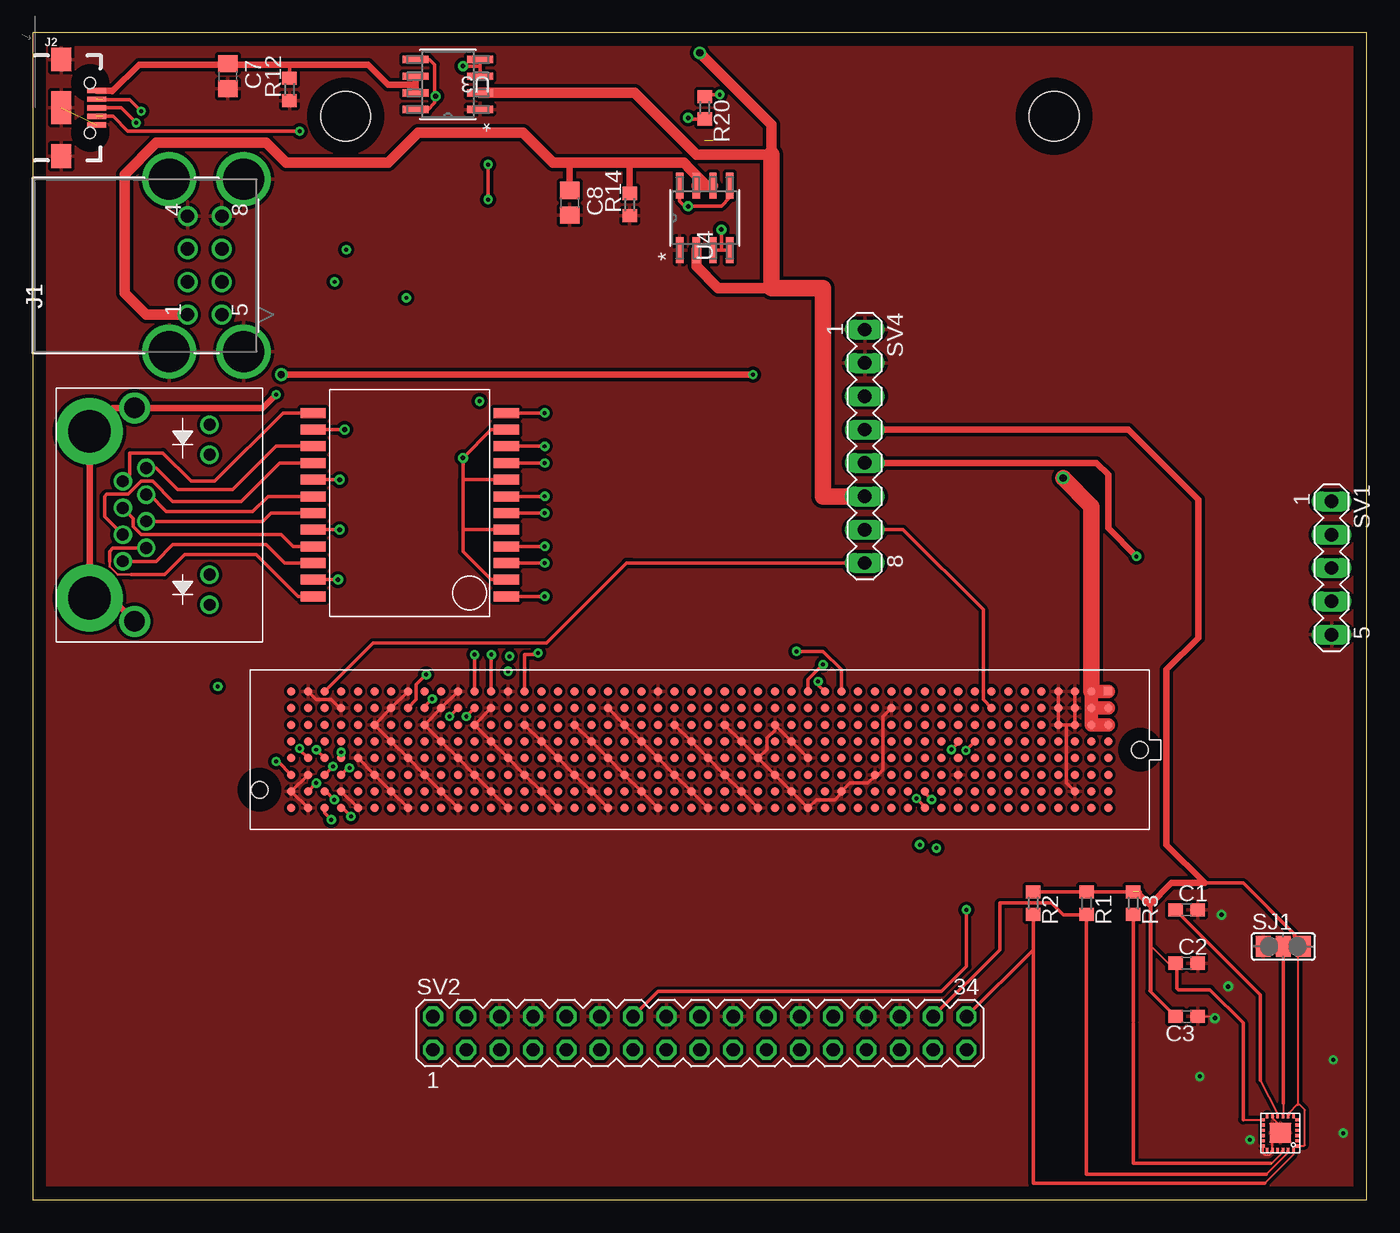
[diagram p6: board, top side]
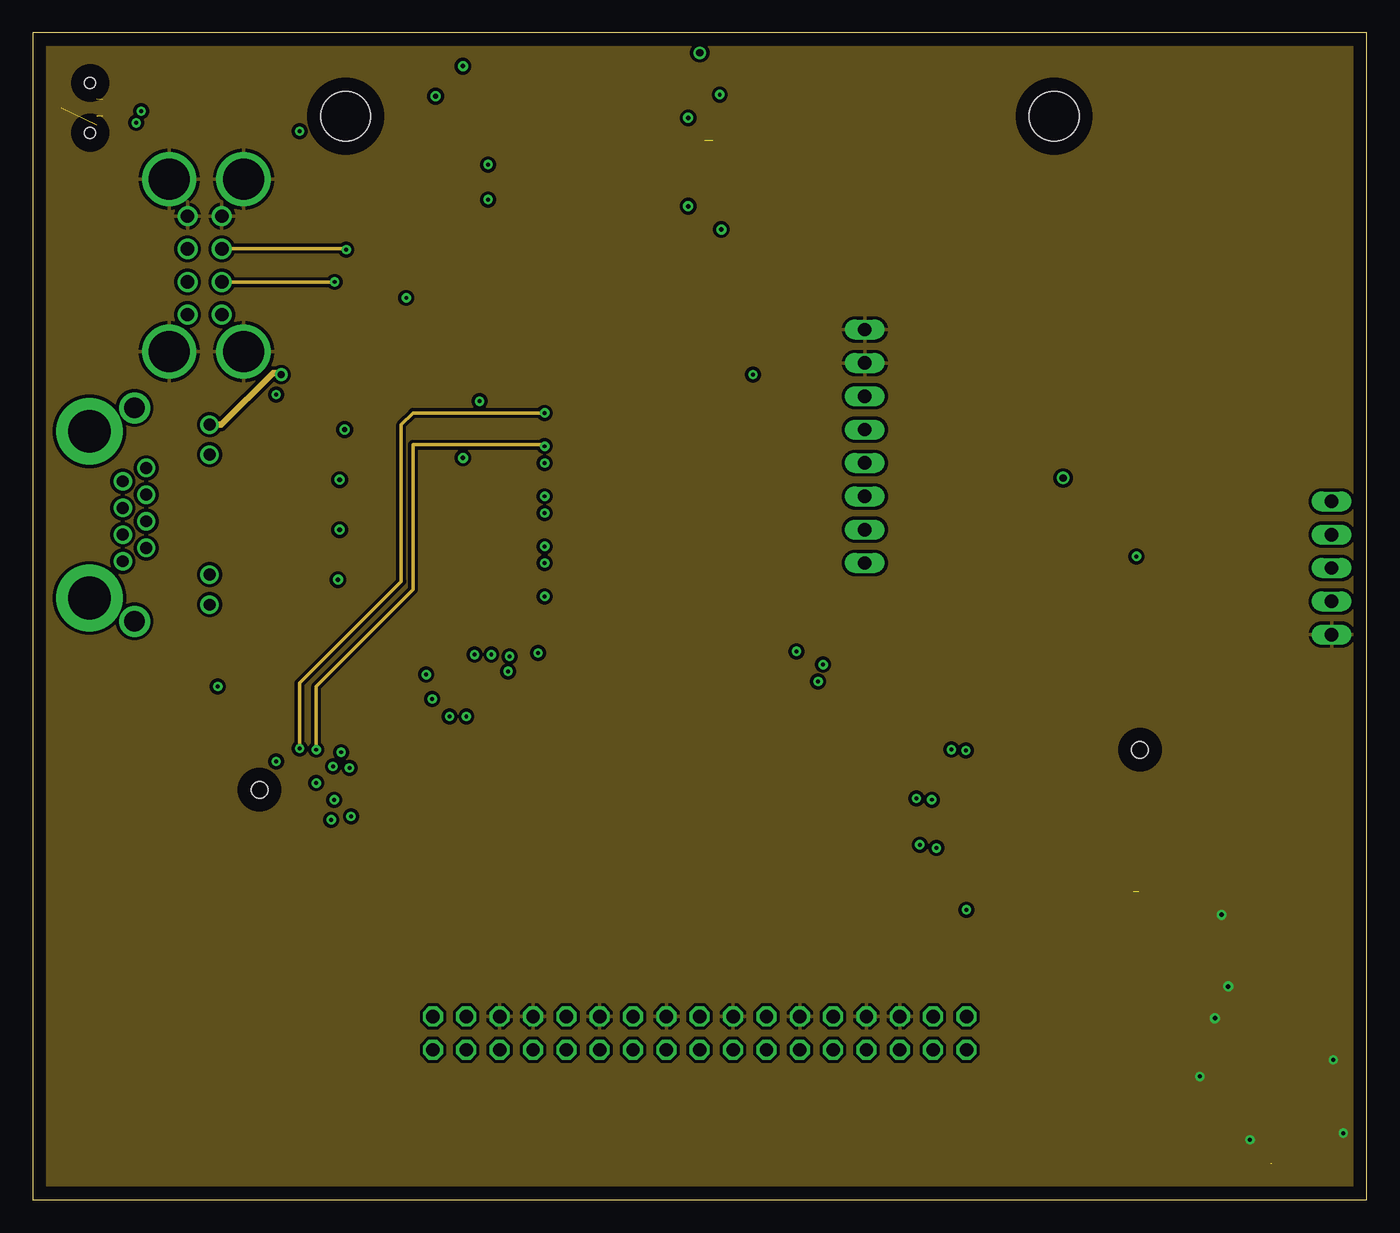
[diagram p7: board, inner layer Route2]
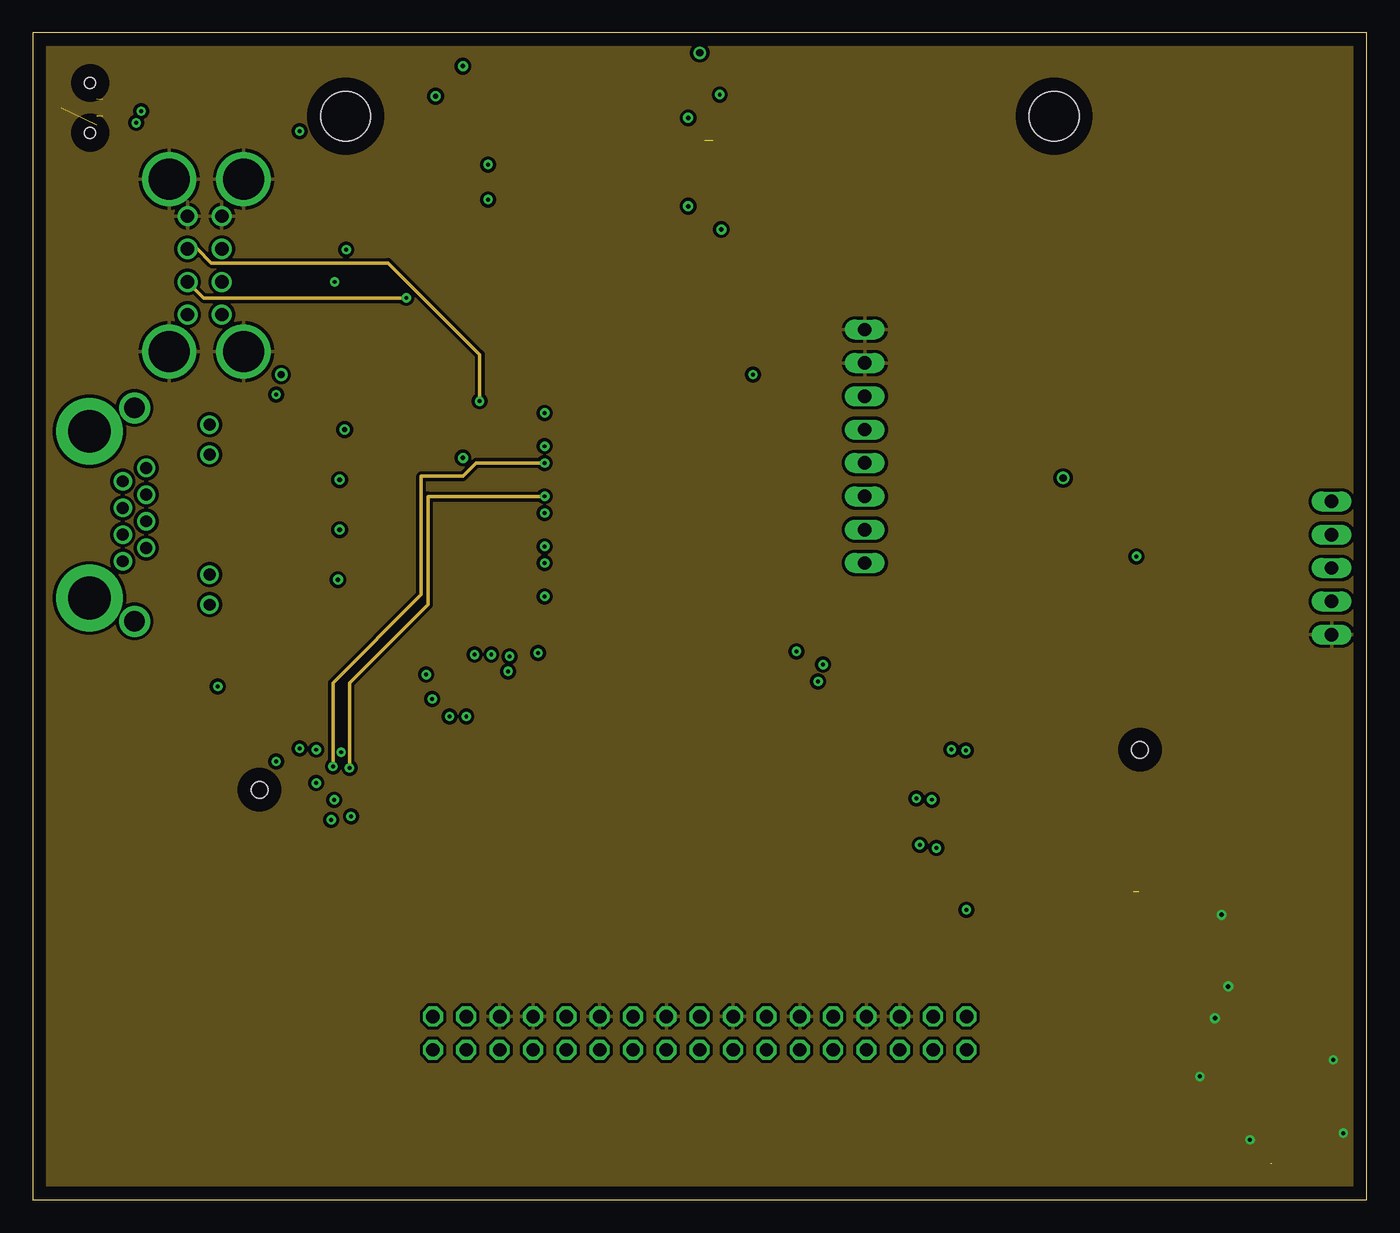
[diagram p8: board, inner layer Route3]
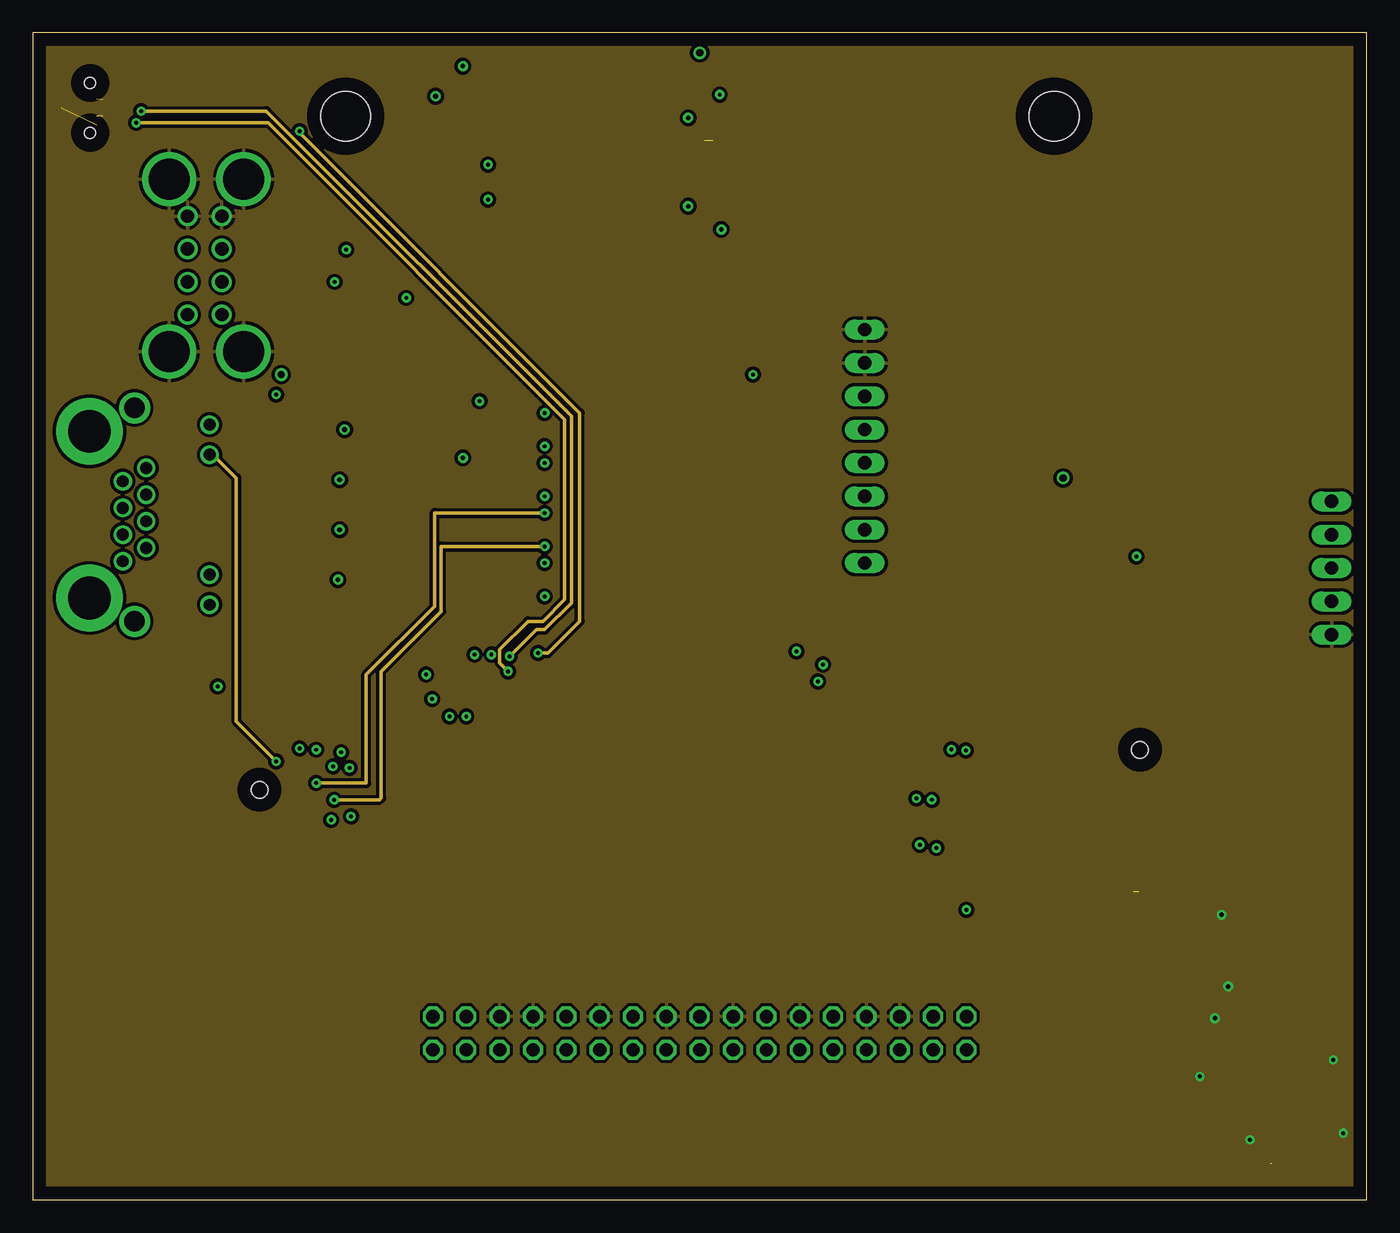
[diagram p9: board, inner layer Route14]
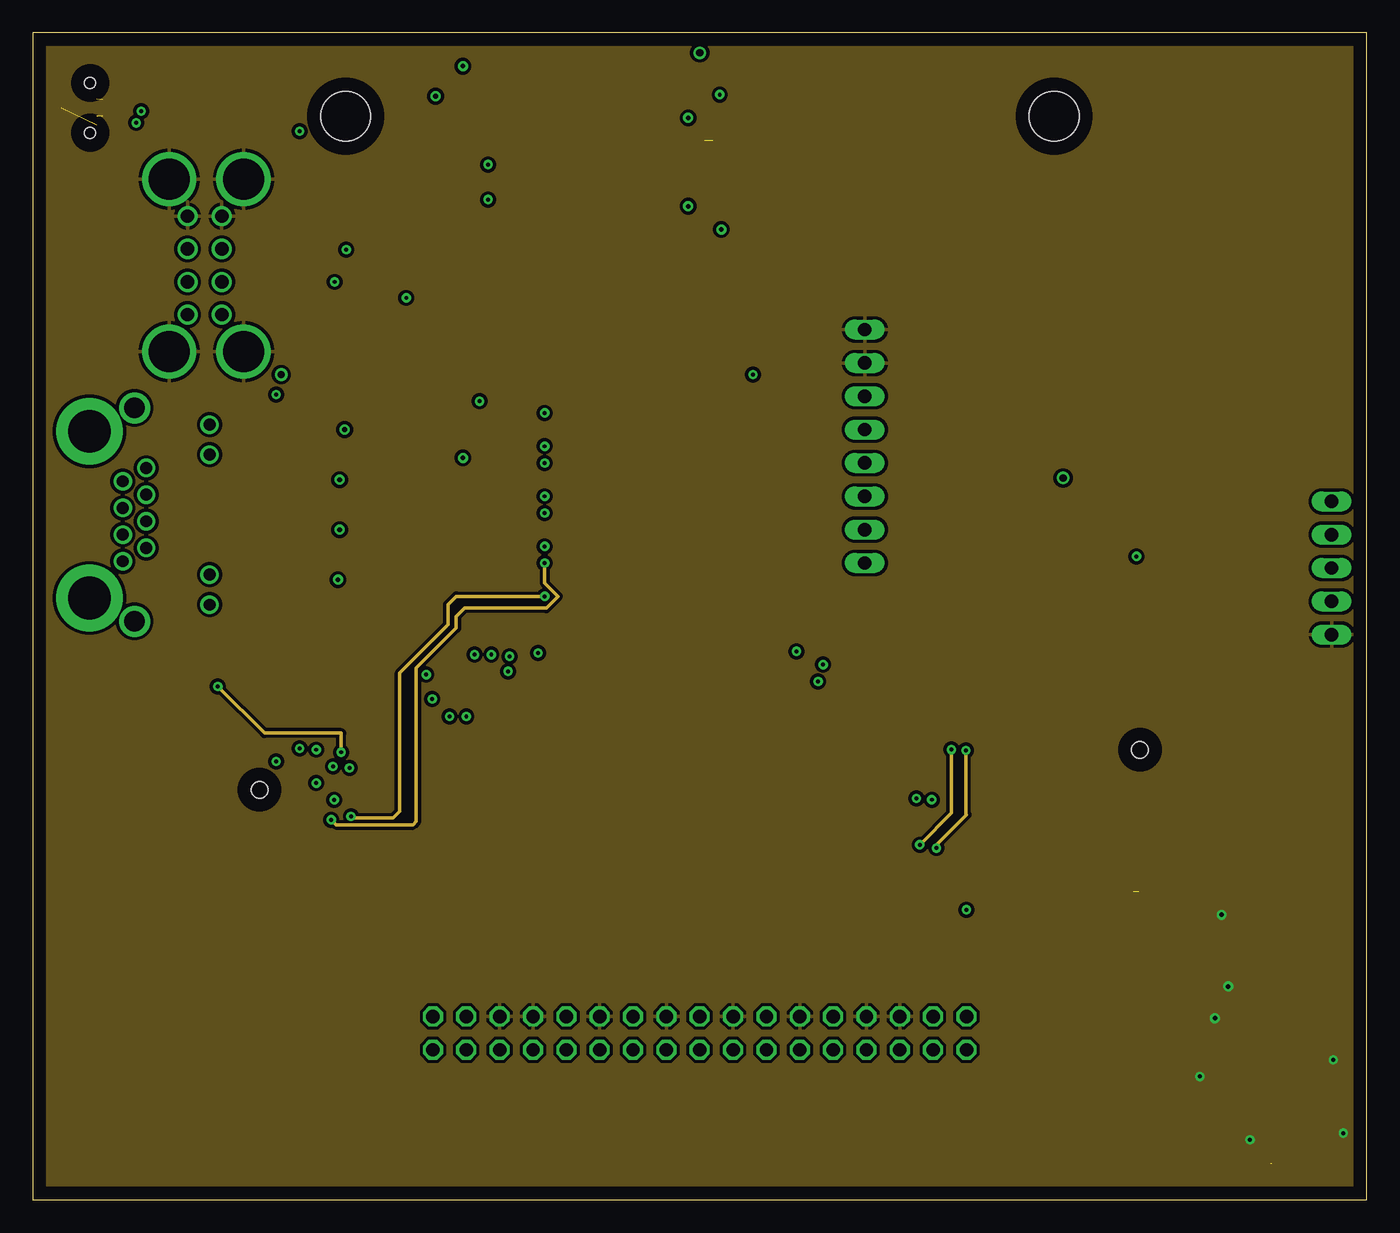
[diagram p10: board, inner layer Route15]
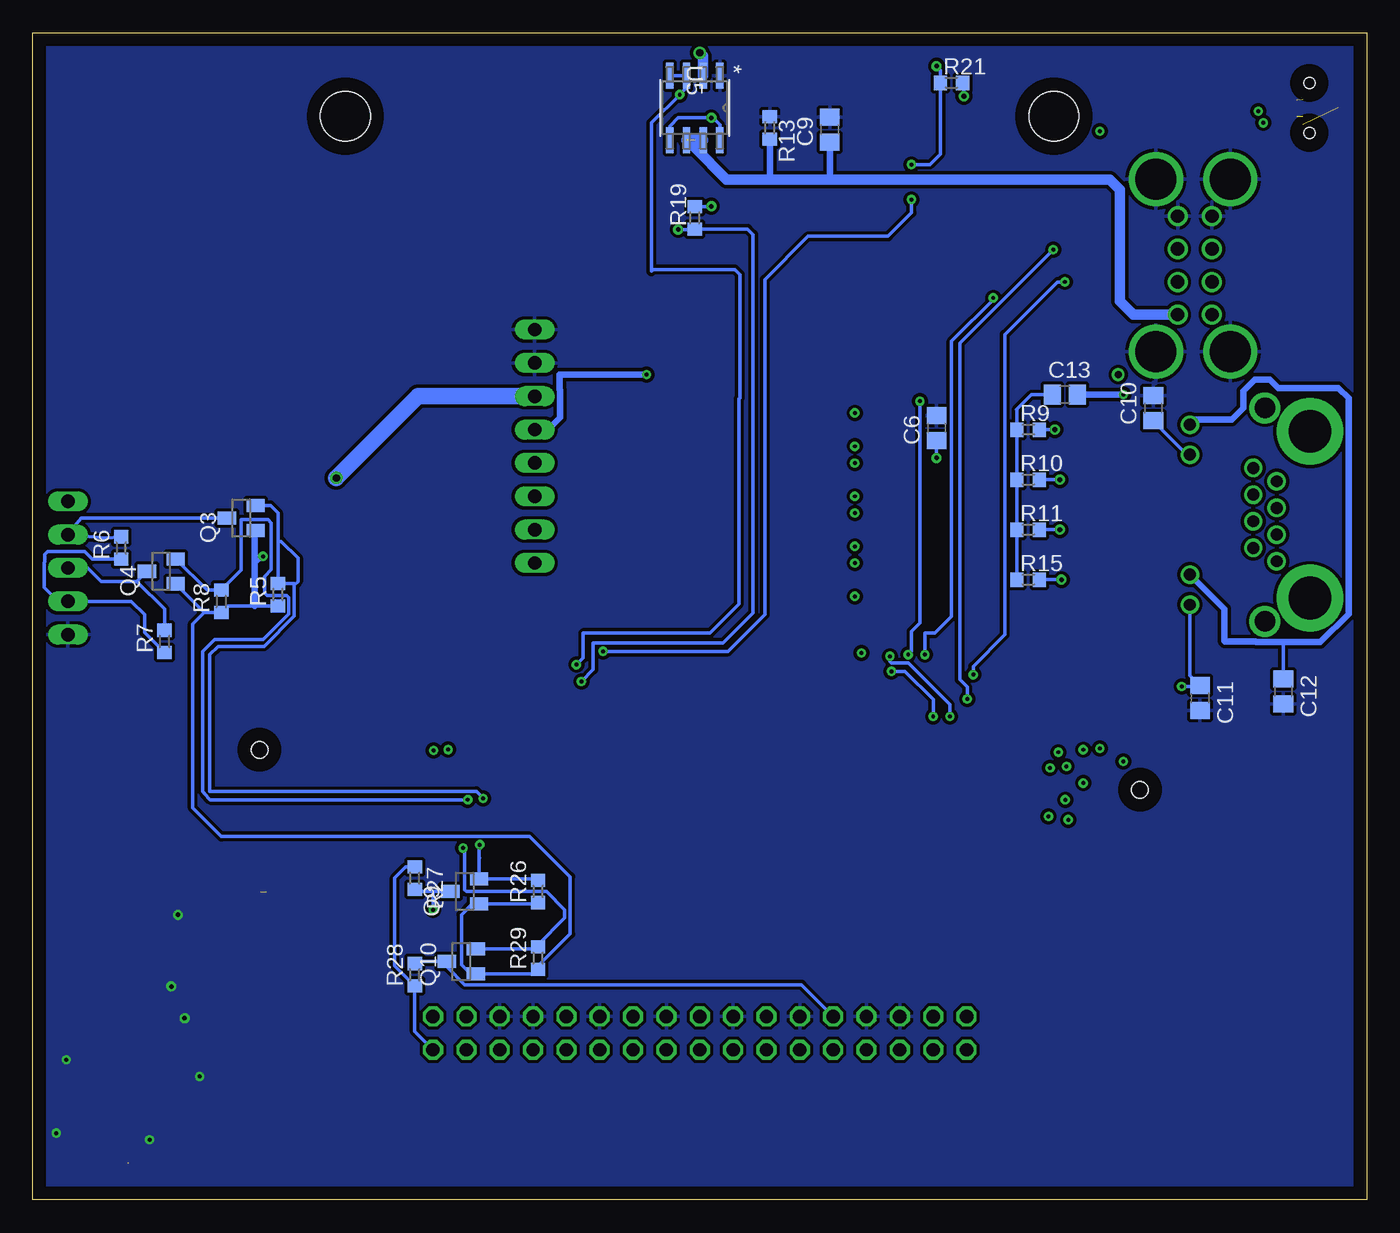
[diagram p11: board, bottom side, seen from below]

Size 101.6 x 88.9 mm. Coordinates in mm from the lower left corner, seen from the top.
Outline: 0,0 101.6,0 101.6,88.9 0,88.9 0,0
Copper layers (1*2*3*14*15*16): Top 0.035mm / dielectric 0.2mm / Route2 0.035mm / dielectric 0.15mm / Route3 0.035mm / dielectric 0.2mm / Route14 0.035mm / dielectric 0.15mm / Route15 0.035mm / dielectric 0.2mm / Bottom 0.035mm
Design rules "default *": minimum track width 6mil, minimum drill 0.35mm, track to track 6mil, track to pad 6mil, pad to pad 6mil, via to via 6mil, smd to smd 6mil, copper to edge 40mil, drill to drill 6mil, minimum pad ring 10mil, minimum via ring 8mil, stop-mask expansion 4mil, vias tented up to drill 0mil, thermal gap 10mil
Holes 3.81 mm at 23.83,82.55 77.8,82.55

### Footprints (pad centres in the part's own frame; a part is rotated, then mirrored left to right if it is on the bottom)
C0603 = smd 1.1 x 1: 1 -0.85,0; 2 0.85,0
C0805 = smd 1.3 x 1.5: 1 -0.95,0; 2 0.95,0
CONN_1903815-1 = drill 1.016 pad 1.524: 1 -3.683,-5.563; 2 -1.194,-5.563; 3 1.321,-5.563; 4 3.81,-5.563; 5 -3.683,-8.179; 6 -1.194,-8.179; 7 1.321,-8.179; 8 3.81,-8.179 | drill 3.124 pad 3.81: SHLD1 -6.502,-4.166; SHLD2 6.629,-4.166; SHLD3 -6.502,-9.83; SHLD4 6.629,-9.83
USB-B-MICRO-SMD = smd 1.45 x 0.4: D+ 2.725,0; D- 2.725,0.65; GND 2.725,-1.3; ID 2.725,-0.65; VBUS 2.725,1.3 | smd 1.5 x 1.8: SHIELD1 0,3.685; SHIELD2 0,-3.685 | smd 1.5 x 2.5: SHIELD3 0,0 | hole 0.85: 2.2,1.9; 2.2,-1.9
SOT23 = smd 1 x 1.4: 1 -0.95,-1.1; 2 0.95,-1.1; 3 0,1.1
R0603 = smd 1 x 1.1: 1 -0.85,0; 2 0.85,0
SJ_2 = smd 1.168 x 1.6: 1 -1.524,0; 2 0,0; 3 1.524,0
MA05-1 = drill 1.016 long: 1 -5.08,0; 2 -2.54,0; 3 0,0; 4 2.54,0; 5 5.08,0
MA17-2 = drill 1.016 octagon: 1 -20.32,-1.27; 2 -20.32,1.27; 3 -17.78,-1.27; 4 -17.78,1.27; 5 -15.24,-1.27; 6 -15.24,1.27; 7 -12.7,-1.27; 8 -12.7,1.27; 9 -10.16,-1.27; 10 -10.16,1.27; 11 -7.62,-1.27; 12 -7.62,1.27; 13 -5.08,-1.27; 14 -5.08,1.27; 15 -2.54,-1.27; 16 -2.54,1.27; 17 0,-1.27; 18 0,1.27; 19 2.54,-1.27; 20 2.54,1.27; 21 5.08,-1.27; 22 5.08,1.27; 23 7.62,-1.27; 24 7.62,1.27; 25 10.16,-1.27; 26 10.16,1.27; 27 12.7,-1.27; 28 12.7,1.27; 29 15.24,-1.27; 30 15.24,1.27; 31 17.78,-1.27; 32 17.78,1.27; 33 20.32,-1.27; 34 20.32,1.27
MA08-1 = drill 1.016 long: 1 -8.89,0; 2 -6.35,0; 3 -3.81,0; 4 -1.27,0; 5 1.27,0; 6 3.81,0; 7 6.35,0; 8 8.89,0
SO8 = smd 1.981 x 0.559: 1 -2.464,1.905; 2 -2.464,0.635; 3 -2.464,-0.635; 4 -2.464,-1.905; 5 2.464,-1.905; 6 2.464,-0.635; 7 2.464,0.635; 8 2.464,1.905
SEAM-50-02.0-L-08-2-A-K-TR = smd 0.64 x 0.64: A1 31.115,4.445; A2 29.845,4.445; A3 28.575,4.445; A4 27.305,4.445; A5 26.035,4.445; A6 24.765,4.445; A7 23.495,4.445; A8 22.225,4.445; A9 20.955,4.445; A10 19.685,4.445; A11 18.415,4.445; A12 17.145,4.445; A13 15.875,4.445; A14 14.605,4.445; A15 13.335,4.445; A16 12.065,4.445; A17 10.795,4.445; A18 9.525,4.445; A19 8.255,4.445; A20 6.985,4.445; A21 5.715,4.445; A22 4.445,4.445; A23 3.175,4.445; A24 1.905,4.445; A25 0.635,4.445; A26 -0.635,4.445; A27 -1.905,4.445; A28 -3.175,4.445; A29 -4.445,4.445; A30 -5.715,4.445; A31 -6.985,4.445; A32 -8.255,4.445; A33 -9.525,4.445; A34 -10.795,4.445; A35 -12.065,4.445; A36 -13.335,4.445; A37 -14.605,4.445; A38 -15.875,4.445; A39 -17.145,4.445; A40 -18.415,4.445; A41 -19.685,4.445; A42 -20.955,4.445; A43 -22.225,4.445; A44 -23.495,4.445; A45 -24.765,4.445; A46 -26.035,4.445; A47 -27.305,4.445; A48 -28.575,4.445; A49 -29.845,4.445; A50 -31.115,4.445; B1 31.115,3.175; B2 29.845,3.175; B3 28.575,3.175; B4 27.305,3.175; B5 26.035,3.175; B6 24.765,3.175; B7 23.495,3.175; B8 22.225,3.175; B9 20.955,3.175; B10 19.685,3.175; B11 18.415,3.175; B12 17.145,3.175; B13 15.875,3.175; B14 14.605,3.175; B15 13.335,3.175; B16 12.065,3.175; B17 10.795,3.175; B18 9.525,3.175; B19 8.255,3.175; B20 6.985,3.175; B21 5.715,3.175; B22 4.445,3.175; B23 3.175,3.175; B24 1.905,3.175; B25 0.635,3.175; B26 -0.635,3.175; B27 -1.905,3.175; B28 -3.175,3.175; B29 -4.445,3.175; B30 -5.715,3.175; B31 -6.985,3.175; B32 -8.255,3.175; B33 -9.525,3.175; B34 -10.795,3.175; B35 -12.065,3.175; B36 -13.335,3.175; B37 -14.605,3.175; B38 -15.875,3.175; B39 -17.145,3.175; B40 -18.415,3.175; B41 -19.685,3.175; B42 -20.955,3.175; B43 -22.225,3.175; B44 -23.495,3.175; B45 -24.765,3.175; B46 -26.035,3.175; B47 -27.305,3.175; B48 -28.575,3.175; B49 -29.845,3.175; B50 -31.115,3.175; C1 31.115,1.905; C2 29.845,1.905; C3 28.575,1.905; C4 27.305,1.905; C5 26.035,1.905; C6 24.765,1.905; C7 23.495,1.905; C8 22.225,1.905; C9 20.955,1.905; C10 19.685,1.905; C11 18.415,1.905; C12 17.145,1.905; C13 15.875,1.905; C14 14.605,1.905; C15 13.335,1.905; C16 12.065,1.905; C17 10.795,1.905; C18 9.525,1.905; C19 8.255,1.905; C20 6.985,1.905; C21 5.715,1.905; C22 4.445,1.905; C23 3.175,1.905; C24 1.905,1.905; C25 0.635,1.905; C26 -0.635,1.905; C27 -1.905,1.905; C28 -3.175,1.905; C29 -4.445,1.905; C30 -5.715,1.905; C31 -6.985,1.905; C32 -8.255,1.905; C33 -9.525,1.905; C34 -10.795,1.905; C35 -12.065,1.905; C36 -13.335,1.905; C37 -14.605,1.905; C38 -15.875,1.905; C39 -17.145,1.905; C40 -18.415,1.905; C41 -19.685,1.905; C42 -20.955,1.905; C43 -22.225,1.905; C44 -23.495,1.905; C45 -24.765,1.905; C46 -26.035,1.905; C47 -27.305,1.905; C48 -28.575,1.905; C49 -29.845,1.905; C50 -31.115,1.905; D1 31.115,0.635; D2 29.845,0.635; D3 28.575,0.635; D4 27.305,0.635; D5 26.035,0.635; D6 24.765,0.635; D7 23.495,0.635; D8 22.225,0.635; D9 20.955,0.635; D10 19.685,0.635; D11 18.415,0.635; D12 17.145,0.635; D13 15.875,0.635; D14 14.605,0.635; D15 13.335,0.635; D16 12.065,0.635; D17 10.795,0.635; D18 9.525,0.635; D19 8.255,0.635; D20 6.985,0.635; D21 5.715,0.635; D22 4.445,0.635; D23 3.175,0.635; D24 1.905,0.635; D25 0.635,0.635; D26 -0.635,0.635; D27 -1.905,0.635; D28 -3.175,0.635; D29 -4.445,0.635; D30 -5.715,0.635; D31 -6.985,0.635; D32 -8.255,0.635; D33 -9.525,0.635; D34 -10.795,0.635; D35 -12.065,0.635; D36 -13.335,0.635; D37 -14.605,0.635; D38 -15.875,0.635; D39 -17.145,0.635; D40 -18.415,0.635; D41 -19.685,0.635; D42 -20.955,0.635; D43 -22.225,0.635; D44 -23.495,0.635; D45 -24.765,0.635; D46 -26.035,0.635; D47 -27.305,0.635; D48 -28.575,0.635; D49 -29.845,0.635; D50 -31.115,0.635; E1 31.115,-0.635; E2 29.845,-0.635; E3 28.575,-0.635; E4 27.305,-0.635; E5 26.035,-0.635; E6 24.765,-0.635; E7 23.495,-0.635; E8 22.225,-0.635; E9 20.955,-0.635; E10 19.685,-0.635; E11 18.415,-0.635; E12 17.145,-0.635; E13 15.875,-0.635; E14 14.605,-0.635; E15 13.335,-0.635; E16 12.065,-0.635; E17 10.795,-0.635; E18 9.525,-0.635; E19 8.255,-0.635; E20 6.985,-0.635; E21 5.715,-0.635; E22 4.445,-0.635; E23 3.175,-0.635; E24 1.905,-0.635; E25 0.635,-0.635; E26 -0.635,-0.635; E27 -1.905,-0.635; E28 -3.175,-0.635; E29 -4.445,-0.635; E30 -5.715,-0.635; E31 -6.985,-0.635; E32 -8.255,-0.635; E33 -9.525,-0.635; E34 -10.795,-0.635; E35 -12.065,-0.635; E36 -13.335,-0.635; E37 -14.605,-0.635; E38 -15.875,-0.635; E39 -17.145,-0.635; E40 -18.415,-0.635; E41 -19.685,-0.635; E42 -20.955,-0.635; E43 -22.225,-0.635; E44 -23.495,-0.635; E45 -24.765,-0.635; E46 -26.035,-0.635; E47 -27.305,-0.635; E48 -28.575,-0.635; E49 -29.845,-0.635; E50 -31.115,-0.635; F1 31.115,-1.905; F2 29.845,-1.905; F3 28.575,-1.905; F4 27.305,-1.905; F5 26.035,-1.905; F6 24.765,-1.905; F7 23.495,-1.905; F8 22.225,-1.905; F9 20.955,-1.905; F10 19.685,-1.905; F11 18.415,-1.905; F12 17.145,-1.905; F13 15.875,-1.905; F14 14.605,-1.905; F15 13.335,-1.905; F16 12.065,-1.905; F17 10.795,-1.905; F18 9.525,-1.905; F19 8.255,-1.905; F20 6.985,-1.905; F21 5.715,-1.905; F22 4.445,-1.905; F23 3.175,-1.905; F24 1.905,-1.905; F25 0.635,-1.905; F26 -0.635,-1.905; F27 -1.905,-1.905; F28 -3.175,-1.905; F29 -4.445,-1.905; F30 -5.715,-1.905; F31 -6.985,-1.905; F32 -8.255,-1.905; F33 -9.525,-1.905; F34 -10.795,-1.905; F35 -12.065,-1.905; F36 -13.335,-1.905; F37 -14.605,-1.905; F38 -15.875,-1.905; F39 -17.145,-1.905; F40 -18.415,-1.905; F41 -19.685,-1.905; F42 -20.955,-1.905; F43 -22.225,-1.905; F44 -23.495,-1.905; F45 -24.765,-1.905; F46 -26.035,-1.905; F47 -27.305,-1.905; F48 -28.575,-1.905; F49 -29.845,-1.905; F50 -31.115,-1.905; G1 31.115,-3.175; G2 29.845,-3.175; G3 28.575,-3.175; G4 27.305,-3.175; G5 26.035,-3.175; G6 24.765,-3.175; G7 23.495,-3.175; G8 22.225,-3.175; G9 20.955,-3.175; G10 19.685,-3.175; G11 18.415,-3.175; G12 17.145,-3.175; G13 15.875,-3.175; G14 14.605,-3.175; G15 13.335,-3.175; G16 12.065,-3.175; G17 10.795,-3.175; G18 9.525,-3.175; G19 8.255,-3.175; G20 6.985,-3.175; G21 5.715,-3.175; G22 4.445,-3.175; G23 3.175,-3.175; G24 1.905,-3.175; G25 0.635,-3.175; G26 -0.635,-3.175; G27 -1.905,-3.175; G28 -3.175,-3.175; G29 -4.445,-3.175; G30 -5.715,-3.175; G31 -6.985,-3.175; G32 -8.255,-3.175; G33 -9.525,-3.175; G34 -10.795,-3.175; G35 -12.065,-3.175; G36 -13.335,-3.175; G37 -14.605,-3.175; G38 -15.875,-3.175; G39 -17.145,-3.175; G40 -18.415,-3.175; G41 -19.685,-3.175; G42 -20.955,-3.175; G43 -22.225,-3.175; G44 -23.495,-3.175; G45 -24.765,-3.175; G46 -26.035,-3.175; G47 -27.305,-3.175; G48 -28.575,-3.175; G49 -29.845,-3.175; G50 -31.115,-3.175; H1 31.115,-4.445; H2 29.845,-4.445; H3 28.575,-4.445; H4 27.305,-4.445; H5 26.035,-4.445; H6 24.765,-4.445; H7 23.495,-4.445; H8 22.225,-4.445; H9 20.955,-4.445; H10 19.685,-4.445; H11 18.415,-4.445; H12 17.145,-4.445; H13 15.875,-4.445; H14 14.605,-4.445; H15 13.335,-4.445; H16 12.065,-4.445; H17 10.795,-4.445; H18 9.525,-4.445; H19 8.255,-4.445; H20 6.985,-4.445; H21 5.715,-4.445; H22 4.445,-4.445; H23 3.175,-4.445; H24 1.905,-4.445; H25 0.635,-4.445; H26 -0.635,-4.445; H27 -1.905,-4.445; H28 -3.175,-4.445; H29 -4.445,-4.445; H30 -5.715,-4.445; H31 -6.985,-4.445; H32 -8.255,-4.445; H33 -9.525,-4.445; H34 -10.795,-4.445; H35 -12.065,-4.445; H36 -13.335,-4.445; H37 -14.605,-4.445; H38 -15.875,-4.445; H39 -17.145,-4.445; H40 -18.415,-4.445; H41 -19.685,-4.445; H42 -20.955,-4.445; H43 -22.225,-4.445; H44 -23.495,-4.445; H45 -24.765,-4.445; H46 -26.035,-4.445; H47 -27.305,-4.445; H48 -28.575,-4.445; H49 -29.845,-4.445; H50 -31.115,-4.445 | hole 1.27: 33.54,0; -33.54,-3.048
2-406549-1 = drill 0.9: 1 0,1.778; 2 1.016,0; 3 2.032,1.778; 4 3.048,0; 5 4.064,1.778; 6 5.08,0; 7 6.096,1.778; 8 7.112,0; ACT1 8.128,6.604; ACT2 10.414,6.604; LINK1 -3.302,6.604; LINK2 -1.016,6.604 | drill 1.575: GND1 -4.572,0.889; GND4 11.684,0.889 | drill 3.251 pad 5.08: GND2 -2.794,-2.54; GND3 9.906,-2.54
QFN3X3 = smd 0.3 x 0.2: P$1 0.2,2.5; P$2 0.2,2.1; P$3 0.2,1.7; P$4 0.2,1.3; P$5 0.2,0.9; P$6 0.2,0.5; P$13 2.8,0.5; P$14 2.8,0.9; P$15 2.8,1.3; P$16 2.8,1.7; P$17 2.8,2.1; P$18 2.8,2.5 | smd 0.2 x 0.3: P$7 0.5,0.2; P$8 0.9,0.2; P$9 1.3,0.2; P$10 1.7,0.2; P$11 2.1,0.2; P$12 2.5,0.2; P$19 2.5,2.8; P$20 2.1,2.8; P$21 1.7,2.8; P$22 1.3,2.8; P$23 0.9,2.8; P$24 0.5,2.8 | smd 1.7 x 1.54: P$25 1.5,1.5
H60XXNL = smd 0.762 x 1.905: P$1 -6.604,6.858; P$2 -5.334,6.858; P$3 -4.064,6.858; P$4 -2.794,6.858; P$5 -1.524,6.858; P$6 -0.254,6.858; P$7 1.016,6.858; P$8 2.286,6.858; P$9 3.556,6.858; P$10 4.826,6.858; P$11 6.096,6.858; P$12 7.366,6.858; P$13 -6.604,-7.874; P$14 -5.334,-7.874; P$15 -4.064,-7.874; P$16 -2.794,-7.874; P$17 -1.524,-7.874; P$18 -0.254,-7.874; P$19 1.016,-7.874; P$20 2.286,-7.874; P$21 3.556,-7.874; P$22 4.826,-7.874; P$23 6.096,-7.874; P$24 7.366,-7.874

### Placement (x,y rotation side)
C1  87.88,22.1 0 top
C2  87.88,18.03 0 top
C3  87.88,13.97 180 top
C6  32.77,58.8 90 bottom
C7  14.86,85.6 270 top
C8  40.89,75.95 270 top
C9  40.89,81.53 90 bottom
C10  16.26,60.33 90 bottom
C11  12.7,38.23 270 bottom
C12  6.35,38.73 270 bottom
C13  22.99,61.34 0 bottom
J1  6.22,71.12 90 top
J2  2.16,83.19 0 top
Q3  85.72,51.94 90 bottom
Q4  91.82,47.88 90 bottom
Q9  68.71,23.5 90 bottom
Q10  68.96,18.16 90 bottom
R1  80.26,22.61 270 top
R2  76.2,22.61 270 top
R3  83.82,22.61 270 top
R5  82.93,46.1 90 bottom
R6  94.87,49.66 90 bottom
R7  91.57,42.55 90 bottom
R8  87.25,45.59 90 bottom
R9  25.78,58.67 0 bottom
R10  25.78,54.86 0 bottom
R11  25.78,51.05 0 bottom
R12  19.56,84.58 90 top
R13  45.47,81.66 270 bottom
R14  45.47,75.82 90 top
R15  25.78,47.24 0 bottom
R19  51.18,74.8 90 bottom
R20  51.18,83.19 270 top
R21  31.62,85.09 0 bottom
R26  63.12,23.5 90 bottom
R27  72.52,24.51 270 bottom
R28  72.52,17.14 90 bottom
R29  63.12,18.41 90 bottom
SJ1  95.25,19.3 0 top
SV1  98.93,48.13 270 top
SV2  50.8,12.7 0 top
SV4  63.37,57.4 270 top
U3  31.62,84.96 180 top
U4  51.18,74.8 90 top
U5  51.18,83.19 270 bottom
U$1  50.8,34.29 0 top
U$3  6.86,55.75 270 top
U$4  96.52,6.6 180 top
U$5  28.19,52.58 90 top

### Tracks (layer width: path | path; a pad name or v marks a point on that pad's centre or on a via)
CARRIER-PWR-EN
  Top 0.254: 45.59,48.51 SV4.8 | 45.59,48.51 45.21,48.51 | U$1.A48 25.91,42.42 39.12,42.42 45.21,48.51 | 45.21,48.51 45.59,48.51
DEBUG-RX  (via drill 0.3)
  Top 0.254: v68.47,30.48 67.94,31.01 U$1.G12
  Bottom 0.254: Q4.2 88.33,46.44 R8.2 85.72,47.97 85.72,51.82 83.69,51.82 83.44,51.56 83.44,48.01 83.95,47.5 83.95,46.23 83.75,46.03 82.27,46.03 82.1,45.87 82.1,44.63 84.06,42.67 87.76,42.67 88.65,41.78 88.65,31.11 88.54,31.01 88.54,30.95 88.08,30.48 68.58,30.48 v68.47,30.48
DEBUG-TX  (via drill 0.3)
  Top 0.254: v67.31,30.58 67.94,29.95 U$1.H12
  Bottom 0.254: 82.93,50.16 82.68,50.16 81.41,48.9 81.41,47.12 81.69,46.83 | Q3.2 83.5,52.89 82.93,52.32 R5.2 81.69,46.95 81.69,46.83 | 81.69,46.83 81.69,44.47 84,42.16 87.5,42.16 88.14,41.53 88.14,31.11 67.82,31.11 67.31,30.61 v67.31,30.58
DEBUG-VIN
  Bottom 0.254: R6.1 97.07,48.81 97.66,49.4 100.46,49.4 100.71,49.15 100.71,48.59 100.74,48.56 100.74,46.63 99.69,45.59 SV1.4 94.11,45.59 93.09,44.58 93.09,43.22 R7.1
GND  (via drill 0.3, 0.35)  (1 unrouted)
  Top 0.152: U$4.P$11 94.49,6.33 94.49,6.17 95.02,5.64 U$4.P$25 94.42,4.5 U$4.P$20 94.35,3.73 94.35,3.56 94.21,3.42 93.83,3.42 93.69,3.56 93.69,4.04 93.72,4.07 U$4.P$18 | C3.1 90.04,13.97 v90.04,13.84
  Top 0.254: U$1.G3 78.74,31.75 78.74,36.2 | 78.74,36.2 U$1.C4 U$1.B4 U$1.A4 | 78.74,36.2 U$1.C3 U$1.B3 U$1.A3 | U$1.E22 U$1.F21 U$1.G20 U$1.H19 59.69,30.48 61.09,30.48 61.59,30.99 U$1.G17 62.23,31.75 63.63,31.75 64.14,32.26 U$1.F15 64.39,32.38 64.77,32.77 64.77,36.83 U$1.B14 | U$1.E22 U$1.D23 U$1.C24 | U$1.E22 55.92,34.33 55.92,35.17 56.52,35.77 U$1.C21 U$1.D20 U$1.E19 | U$1.H22 U$1.G23 U$1.F24 U$1.E25 U$1.D26 U$1.C27 | U$1.H25 U$1.G26 U$1.F27 U$1.E28 U$1.D29 U$1.C30 U$1.B31 | U$1.H28 U$1.G29 U$1.F30 U$1.E31 U$1.D32 U$1.C33 | U$1.H31 U$1.G32 U$1.F33 U$1.E34 U$1.D35 U$1.C36 | U$1.B38 U$1.C39 U$1.D38 U$1.E37 U$1.F36 U$1.G35 U$1.H34 | U$1.H37 U$1.G38 U$1.F39 U$1.E40 U$1.D41 U$1.C42 U$1.B41 U$1.A40 | U$1.H40 U$1.G41 U$1.F42 U$1.E43 U$1.D44 U$1.C45 U$1.B44 U$1.A43 | U$1.H43 U$1.G44 U$1.F45 U$1.E46 | U$1.H46 U$1.G47 | U$1.F49 U$1.G50 U$1.H49 | U$1.A49 21.59,38.1 22.73,38.1 23.37,37.47 U$1.B47
  other vias: 91.06,16.26 90.55,21.72 88.9,9.4 92.71,4.57 99.82,5.08 99.06,10.67
  pour Top (isolate 0.254): -0.25,89.15 101.85,89.15 101.85,-0.25 -0.25,-0.25
  pour Route2 (isolate 0.254): -0.51,89.41 102.11,89.41 102.11,87.63 102.11,-0.51 101.6,-0.51 -0.51,-0.51
  pour Route3 (isolate 0.254): -0.76,89.66 102.36,89.66 102.36,-0.76 98.04,-0.76 -0.76,-0.76
  pour Route14 (isolate 0.254): -1.02,89.92 102.62,89.92 102.62,89.41 102.62,-1.02 -1.02,-1.02
  pour Route15 (isolate 0.254): -1.27,90.17 102.87,90.17 102.87,-1.27 -1.27,-1.27
  pour Bottom (isolate 0.254): -1.52,90.42 103.12,90.42 103.12,-1.52 -1.52,-1.52
LINK-100  (via drill 0.3)
  Top 0.254: U$1.F50 18.67,33.4 v18.54,33.4
  Route14 0.254: v18.54,33.4 15.49,36.45 15.49,54.99 13.72,56.77 U$3.LINK2
  Bottom 0.254: U$3.LINK2 13.61,56.77 arc45 13.79,56.84 16.26,59.31 C10.1
LINK-ACT  (via drill 0.3)
  Top 0.254: U$1.E47 v23.5,34.1 v23.49,34.1
  Route15 0.254: v23.49,34.1 23.49,35.56 23.5,35.56 17.65,35.56 v14.1,39.12
  Bottom 0.254: 12.88,39.36 C11.1 13.46,39.94 U$3.ACT2 | 12.88,39.36 arc45 12.95,39.54 | v14.1,39.12 13.12,39.12 12.88,39.36
MDI0N  (via drill 0.3)
  Top 0.254: U$5.P$24 v38.99,59.94 | U$1.E49 20.32,34.29 v20.32,34.39
  Route2 0.254: v38.99,59.94 28.96,59.94 28.07,59.05 28.07,47.12 20.32,39.37 v20.32,34.39
MDI0P  (via drill 0.3)
  Top 0.254: U$5.P$22 v38.99,57.4 | U$1.E48 v21.59,34.29
  Route2 0.254: v38.99,57.4 38.86,57.53 28.96,57.53 28.96,46.48 21.59,39.12 v21.59,34.29
MDI1N  (via drill 0.3)
  Top 0.254: U$5.P$21 v38.99,56.13 | U$1.F48 v22.86,33.02
  Route3 0.254: v38.99,56.13 33.78,56.13 32.77,55.12 29.59,55.12 29.59,46.1 22.86,39.37 v22.86,33.02
MDI1P  (via drill 0.3)
  Top 0.254: U$5.P$19 v38.99,53.59 | U$1.F47 24.02,32.91 v24.12,32.91
  Route3 0.254: v38.99,53.59 30.1,53.59 30.1,45.34 24.13,39.37 v24.13,32.92 v24.12,32.91
MDI2N  (via drill 0.3)
  Top 0.254: U$5.P$18 v38.99,52.32 | U$1.G49 v21.59,31.75
  Route14 0.254: v38.99,52.32 30.61,52.32 30.61,45.21 25.4,40.01 25.4,31.75 v21.59,31.75
MDI2P  (via drill 0.3)
  Top 0.254: U$5.P$16 v38.99,49.78 | U$1.G48 22.33,31.11 v22.96,30.48
  Route14 0.254: v38.99,49.78 31.11,49.78 31.11,44.83 26.54,40.26 26.54,30.61 26.42,30.48 v22.96,30.48
MDI3N  (via drill 0.3)
  Top 0.254: U$5.P$15 v38.99,48.51 | U$1.H48 22.23,29.46 v22.73,28.96
  Route15 0.254: v38.99,48.51 38.99,46.99 40.01,45.97 39.12,45.09 32.89,45.09 32.26,44.45 32.26,43.56 29.21,40.51 29.21,28.83 28.96,28.57 23.11,28.57 v22.73,28.96
MDI3P  (via drill 0.3)
  Top 0.254: U$5.P$13 v38.99,45.97 | U$1.H47 23.6,29.84 v24.23,29.21
  Route15 0.254: v24.23,29.21 24.26,29.18 24.26,29.08 27.43,29.08 27.94,29.59 27.94,40.13 31.62,43.81 31.62,45.34 32.26,45.97 v38.99,45.97
MXP-RIO-RX
  Bottom 0.254: R28.2 72.35,18.16 Q10.3 70.06,17.74 68.71,16.38 43.05,16.38 SV2.10
MXP-RIO-TX  (via drill 0.3)
  Top 0.254: SV2.14 47.62,15.88 69.22,15.88 71.12,17.78 v71.12,22.1
  Bottom 0.254: 71.12,23.5 72.35,23.5 R27.2 | 71.12,23.5 Q9.3 69.85,23.5 | v71.12,22.1 71.12,23.5
N$1  (via drill 0.3)
  Top 0.254: 8,60.58 U$3.GND1 | 16.13,60.33 16,60.33
  Top 0.508: v18.54,61.34 17.53,60.33 16.13,60.33 | 16,60.33 U$3.GND1 6.1,60.33 U$3.GND2 U$3.GND3 5.97,45.85 U$3.GND4
  Bottom 0.508: C13.2 v18.54,61.34
N$4  (via drill 0.35)
  Top 0.254: R20.2 50,82.33 v49.91,82.42
  Bottom 0.254: U5.8 49.28,81.92 49.78,82.42 v49.91,82.42 52.45,82.42 53.09,81.79 U5.5
N$5  (via drill 0.35)
  Top 0.254: U4.8 49.28,76.07 49.66,75.69 v49.91,75.69 52.45,75.69 53.09,76.33 U4.5
  Bottom 0.254: R19.2 49.95,75.65 v49.91,75.69
N$6  (via drill 0.35)
  Top 0.254: U3.8 30.1,83.06 30.61,83.57 30.61,83.82 | 30.61,83.82 30.61,86.49 30.23,86.87 U3.5 | 30.61,83.82 30.61,84 v30.68,84.07
  Bottom 0.254: v30.68,84.07 30.68,85 R21.2
N$7
  Top 0.152: U$4.P$10 94.8,6.43 94.8,6.59 93.51,9.1
  Top 0.254: C1.1 93.51,15.62 93.51,9.1
N$8
  Top 0.152: 95.25,7.37 95.25,6.43 U$4.P$9
  Top 0.254: SJ1.2 95.25,7.37
N$9  (1 unrouted)
  Top 0.152: 83.82,13.59 83.82,13.46 | U$4.P$22 95.15,3.73 95.15,3.56 94.38,2.79
  Top 0.254: 83.82,13.46 83.82,2.79 94.31,2.79 | R3.2 83.82,13.59
N$48  (via drill 0.35)
  Top 0.254: U$5.P$11 v23.75,58.67
  Bottom 0.254: R9.2 v23.75,58.67
N$49  (via drill 0.35)
  Top 0.254: U$5.P$8 v23.37,54.86
  Bottom 0.254: R10.2 v23.37,54.86
N$50  (via drill 0.35)
  Top 0.254: U$5.P$5 v23.37,51.05
  Bottom 0.254: R11.2 v23.37,51.05
N$51  (via drill 0.35)
  Top 0.254: U$5.P$2 v23.24,47.24
  Bottom 0.254: R15.2 v23.24,47.24
N$52
  Bottom 0.254: R15.1 R11.1 R10.1 R9.1 26.63,60.16 26.67,60.2 25.53,61.34 C13.1
N$72  (via drill 0.35)
  Top 0.254: U$5.P$14 34.92,47.24 32.77,49.4 32.77,51.05 | 32.77,51.05 32.77,54.86 | 32.77,54.86 v32.77,56.52 34.92,58.67 U$5.P$23 | 32.77,54.86 U$5.P$20 | U$5.P$17 32.77,51.05
  Bottom 0.254: v32.77,56.52 C6.1
OUT-RX
  Bottom 0.254: R6.2 96.14,50.42 SV1.2 97.92,51.94 Q3.3
OUT-TX
  Bottom 0.254: SV1.3 97.41,48.13 96.39,47.12 93.68,47.12 | 93.68,47.12 Q4.3 | R7.2 91.57,45 93.68,47.12
RIO-RX  (via drill 0.3)
  Top 0.254: v71.07,34.24 U$1.D9
  Route15 0.254: v68.83,26.8 68.83,27.05 71.12,29.34 71.07,29.39 v71.07,34.24
  Bottom 0.254: Q10.2 63.27,19.11 R29.2 63.12,19.43 61.09,21.46 61.09,22.1 62.48,23.5 68.58,23.5 68.71,23.62 68.71,26.67 v68.83,26.8
RIO-TX  (via drill 0.3)
  Top 0.254: v69.97,34.3 70.48,34.82 U$1.D10
  Route15 0.254: v67.56,27.05 69.98,29.46 69.98,34.29 v69.97,34.3
  Bottom 0.254: R26.2 63.22,24.45 Q9.2 67.61,25.99 | 67.61,25.99 67.56,26.04 | 67.61,25.99 67.61,27.01 v67.56,27.05
RIO-VDD
  Bottom 0.254: R27.1 73.19,25.36 74.04,24.51 74.04,17.82 R28.1 72.52,12.83 SV2.33
RJ45-RD1N
  Top 0.254: U$3.8 9.4,48.64 10.67,49.91 17.78,49.91 19.18,48.51 U$5.P$3
RJ45-RD1P
  Top 0.203: 5.84,48.64 5.84,48.24 6.46,47.62 7.49,47.62
  Top 0.254: 5.84,48.64 5.84,49.4 6.1,49.66 U$3.7 | 7.49,47.62 10.03,47.62 11.56,49.15 17.02,49.15 20.19,45.97 U$5.P$1
RJ45-RDN
  Top 0.254: U$3.6 5.46,52.07 5.46,53.59 5.62,53.75 7.26,53.75 8.25,54.74 9.14,54.74 10.67,53.21 15.88,53.21 18.8,56.13 U$5.P$9
RJ45-RDP
  Top 0.254: U$3.3 8.89,53.72 10.16,52.45 16.76,52.45 17.91,53.59 U$5.P$7
RJ45-TD1N
  Top 0.254: 8.76,51.82 U$3.5 17.53,51.69 18.16,52.32 U$5.P$6
RJ45-TD1P
  Top 0.254: U$3.4 7.65,51.91 7.65,51.28 8.26,50.67 18.92,50.67 19.81,49.78 U$5.P$4
RJ45-TDN
  Top 0.254: U$3.2 7.37,55.24 7.37,56.9 9.91,56.9 12.06,54.74 13.84,54.74 19.05,59.94 U$5.P$12
RJ45-TDP
  Top 0.254: U$3.1 9.4,55.75 11.05,54.1 15.24,54.1 18.54,57.4 U$5.P$10
SCL
  Top 0.152: 80.26,15.11 80.26,21.72 R1.2 78.45,21.76 78.36,21.84 78.3,21.91 | U$4.P$23 95.55,3.73 95.55,3.53 93.95,1.94 93.92,1.91 | 77.6,22.61 77.66,22.54
  Top 0.254: R1.2 80.26,21.72 | 80.26,21.72 80.26,1.94 93.95,1.94 | SV2.32 73.66,19.05 73.66,22.61 77.6,22.61 | 77.66,22.54 78.3,21.91 | 78.36,21.84 78.49,21.72 80.26,21.72
SDA
  Top 0.152: U$4.P$24 96.02,3.44 93.85,1.27 | 76.2,19.18 76.2,21.72 R2.2
  Top 0.254: 93.85,1.27 76.2,1.27 76.2,19.18 | 76.2,19.18 76.2,21.72 | SV2.34 76.2,19.05 76.2,19.18
USB0-EN  (via drill 0.3, 0.35)
  Top 0.254: 34.09,86.23 U3.4 | 34.09,86.23 U3.3 | v32.77,86.36 33.96,86.36 34.09,86.23 | U$1.A17 61.59,40.39 60.2,41.78 v58.17,41.78 | v58.17,41.78 58.04,41.78 v58.17,41.78 | v34.67,78.87 v34.67,76.2
  Bottom 0.254: v32.77,86.36 32.47,86.07 R21.1 32.47,79.67 33.27,78.87 v34.67,78.87 | v34.67,76.2 34.67,75.18 36.45,73.41 42.55,73.41 45.85,70.1 45.85,44.58 48.64,41.78 v58.17,41.78
USB1-DN  (via drill 0.3)
  Top 0.254: U$1.A39 v33.66,41.53
  Route3 0.254: J1.2 13.01,68.71 v28.45,68.71
  Bottom 0.254: v33.66,41.53 33.66,43.18 32.89,43.18 31.62,44.45 31.62,65.41 28.32,68.71 v28.45,68.71
USB1-DP  (via drill 0.3)
  Top 0.254: U$1.A38 v34.92,41.53
  Route3 0.254: J1.3 12.52,72.44 13.59,71.37 27.05,71.37 34.04,64.39 v34.04,60.83
  Bottom 0.254: v34.04,60.83 34.04,43.94 34.67,43.31 34.67,41.78 v34.92,41.53
USB1-EN  (via drill 0.3, 0.35)
  Top 0.254: 52.45,72.34 U4.4 | 52.45,72.34 U4.3 | v52.45,73.91 52.45,72.34 | U$1.A18 59.82,39.24 v59.82,39.49
  Bottom 0.254: v52.45,73.91 51.22,73.91 R19.1 47.16,73.95 46.74,73.53 46.74,44.7 49.02,42.42 58.93,42.42 58.93,40.39 v59.82,39.49
USB2-DN  (via drill 0.3)
  Top 0.254: U$1.B43 29.21,38.1 29.21,39.24 v29.97,40.01
  Route2 0.254: J1.6 v22.99,69.93
  Bottom 0.254: v29.97,40.01 29.97,40.64 27.56,43.05 27.56,65.91 23.55,69.93 v22.99,69.93
USB2-DP  (via drill 0.3)
  Top 0.254: U$1.B42 29.84,37.57 v30.43,38.15
  Route2 0.254: v23.88,72.39 23.82,72.44 J1.7
  Bottom 0.254: v30.43,38.15 30.43,39.06 30.99,39.62 30.99,65.28 v23.88,72.39
USB2-EN  (via drill 0.3)
  Top 0.254: U$1.A19 59.05,39.62 v60.2,40.77 | v52.32,84.2 51.35,84.2 R20.1
  Bottom 0.254: v60.2,40.77 59.69,41.27 59.69,43.18 50.04,43.18 47.82,45.4 47.82,61.02 47.75,61.09 47.75,70.48 48.13,70.87 54.36,70.87 54.48,70.74 54.48,82.04 v52.32,84.2 52.26,84.26 51.82,84.71 U5.3 U5.4
USB-OTG-DN  (via drill 0.3)  (1 unrouted)
  Top 0.254: U$1.B40 v31.75,36.83 | v8.26,82.93 7.37,83.82 5.31,83.82
  Route14 0.254: v36.32,41.4 38.35,43.43 38.99,43.43 41.02,45.47 41.02,59.69 17.78,82.93 v8.26,82.93
  Bottom 0.254: v31.75,36.83 31.75,37.72 34.92,40.89 36.2,40.89 36.32,41.02 v36.32,41.4
USB-OTG-DP  (via drill 0.3)
  Top 0.254: U$1.B39 v33.02,36.83 | J2.D+ 6.73,83.19 v7.87,82.04
  Route14 0.254: v36.2,40.26 35.56,40.89 35.56,41.91 37.72,44.07 38.86,44.07 40.51,45.72 40.51,59.44 17.91,82.04 v7.87,82.04
  Bottom 0.254: v33.02,36.83 33.02,38.1 35.18,40.26 v36.2,40.26
USB-OTG-ID  (via drill 0.3)  (1 unrouted)
  Top 0.254: U$1.A36 37.47,41.53 38.35,41.53 v38.48,41.66 | v20.32,81.41 7.24,81.41 6.11,82.53 5.33,82.53
  Route14 0.254: v38.48,41.66 39.24,41.66 41.66,44.07 41.66,59.94 20.32,81.28 v20.32,81.41
VCC  (via drill 0.55)
  Top 0.813: U3.2 45.85,84.33 50.55,79.63 56.26,79.63 56.26,81.92 v50.8,87.38 | U4.2 50.55,71.12 52.2,69.47 56.26,69.47
  Top 1.27: 56.26,79.63 56.26,69.47 60.2,69.47 60.2,53.59 SV4.6
  Bottom 0.813: U5.2 50.55,87.12 v50.8,87.38
VCC-USB0
  Top 0.254: 6.05,84.45 6.02,84.48 5.93,84.48 | C7.1 14.86,86.49 | R12.2 19.56,86.49
  Top 0.508: 29.16,84.96 U3.6 | 29.16,84.96 U3.7 | J2.VBUS 5.93,84.48 | 29.16,84.96 27.05,84.96 25.53,86.49 19.56,86.49 14.86,86.49 8.09,86.49 6.05,84.45
VCC-USB1
  Top 0.508: 45.47,78.99 R14.2 | 40.89,78.99 C8.1
  Top 0.813: U4.7 51.31,77.27 | 51.31,77.27 U4.6 | 51.31,77.27 50.11,78.46 50.11,78.49 49.61,78.99 45.47,78.99 40.89,78.99 39.62,78.99 37.34,81.28 29.34,81.28 27.05,78.99 19.3,78.99 17.78,80.52 9.4,80.52 6.99,78.11 6.99,69.09 8.64,67.44 J1.1
VCC-USB2  (1 unrouted)
  Bottom 0.508: 40.89,77.72 C9.1 | 45.47,77.72 R13.2
  Bottom 0.813: U5.7 U5.6 | 51.18,80.72 51.18,80.14 48.77,77.72 45.47,77.72 40.89,77.72 19.56,77.72 18.8,76.96 18.8,68.45 17.78,67.44 J1.5
VDD  (via drill 0.3, 0.55)  (1 unrouted)
  Top 0.152: 89.66,16 89.53,16 | 87.14,17.93 C2.1 86.49,18.03 85.09,19.43 | 92.19,6.1 U$4.P$13 | SJ1.3 96.71,19.37 | 96.71,19.37 96.06,20.02 96.06,20.2 92.13,24.13 89.28,24.13 | 85.09,19.43 85.09,22.48 | 85.09,15.91 85.09,19.43 | U$4.P$1 96.81,4.1 96.9,4.19 96.9,6.86 96.52,7.24 96.39,7.24 | U$4.P$8 95.69,6.47 95.69,6.64 96.29,7.24 96.39,7.24 | 96.39,7.24 96.39,19.05 96.71,19.37 | R3.1 R1.1 80.14,23.46 R2.1
  Top 0.254: 89.66,16 92.19,13.47 92.19,6.1 | 89.53,16 87.25,16 87.14,16.11 87.14,17.93 | C3.2 85.17,15.83 | 85.17,15.83 85.09,15.91 | 85.17,15.83 85.17,22.52 84.26,23.43 84.24,23.46 | R3.1 80.14,23.46 | R1.1 R2.1 | SJ1.3 96.11,19.96 96.11,20.22 92.2,24.13 89.28,24.13
  Top 0.508: 84.26,23.43 84.26,23.3 85.09,22.48 86.74,24.13 89.28,24.13 86.36,27.05 86.36,40.39 88.77,42.8 88.77,53.34 83.44,58.67 SV4.4 | v54.86,62.87 v18.92,62.87
  Route2 0.508: U$3.LINK1 14.35,59.05 18.29,62.99 18.8,62.99 v18.92,62.87
  Bottom 0.254: 10.86,42.61 10.79,42.55 | C12.1 6.35,42.48
  Bottom 0.508: U$3.ACT1 10.86,45.02 10.86,42.61 | 10.79,42.55 8.47,42.55 8.4,42.48 6.35,42.48 3.52,42.48 1.37,44.63 1.37,58.62 1.37,61.06 2.16,61.85 6.73,61.85 7.37,62.48 8.51,62.48 9.4,61.59 9.4,60.33 10.29,59.44 13.08,59.44 U$3.LINK1 | SV4.4 62.36,58.67 61.44,59.59 61.44,61.7 61.47,61.72 61.47,62.87 v54.86,62.87
VDD-SOM  (via drill 0.55)
  Top 1.016: U$1.B2 U$1.A2 U$1.A1 | U$1.B2 U$1.C2 U$1.C1 | U$1.B2 U$1.B1
  Top 1.27: U$1.A2 80.64,52.83 v78.49,54.99
  Bottom 1.27: v78.49,54.99 72.26,61.21 SV4.3
VIN-PWR-BAD
  Top 0.254: SV4.7 66.29,51.05 72.39,44.96 72.39,38.1 U$1.B8
VSS  (via drill 0.3)
  Top 0.508: SV4.5 81.03,56.13 81.92,55.24 81.92,51.18 v84.07,49.02
  Bottom 0.254: R5.1 84.71,45.25 86.74,45.25 R8.1 88.53,44.74 | R26.1 63.22,22.55 Q9.1 68.13,22.55 68.96,21.72 68.96,17.91 68.27,17.21 Q10.1 63.47,17.21 R29.1 63.12,17.82 60.68,20.26 60.68,24.61 63.75,27.69 87.25,27.69 89.41,29.84 89.41,43.87 88.53,44.74 | 88.53,44.74 Q4.1 | 84.62,48.13 84.62,48.47 v84.07,49.02
  Bottom 0.508: Q3.1 84.71,50.91 84.71,48.9 | 84.71,48.9 84.71,45.25 | v84.07,49.02 84.2,48.9 84.71,48.9